# EAGLE schematic RelayBoard (EAGLE 9.6.2)

## Sheet 1 of 9: Frontend
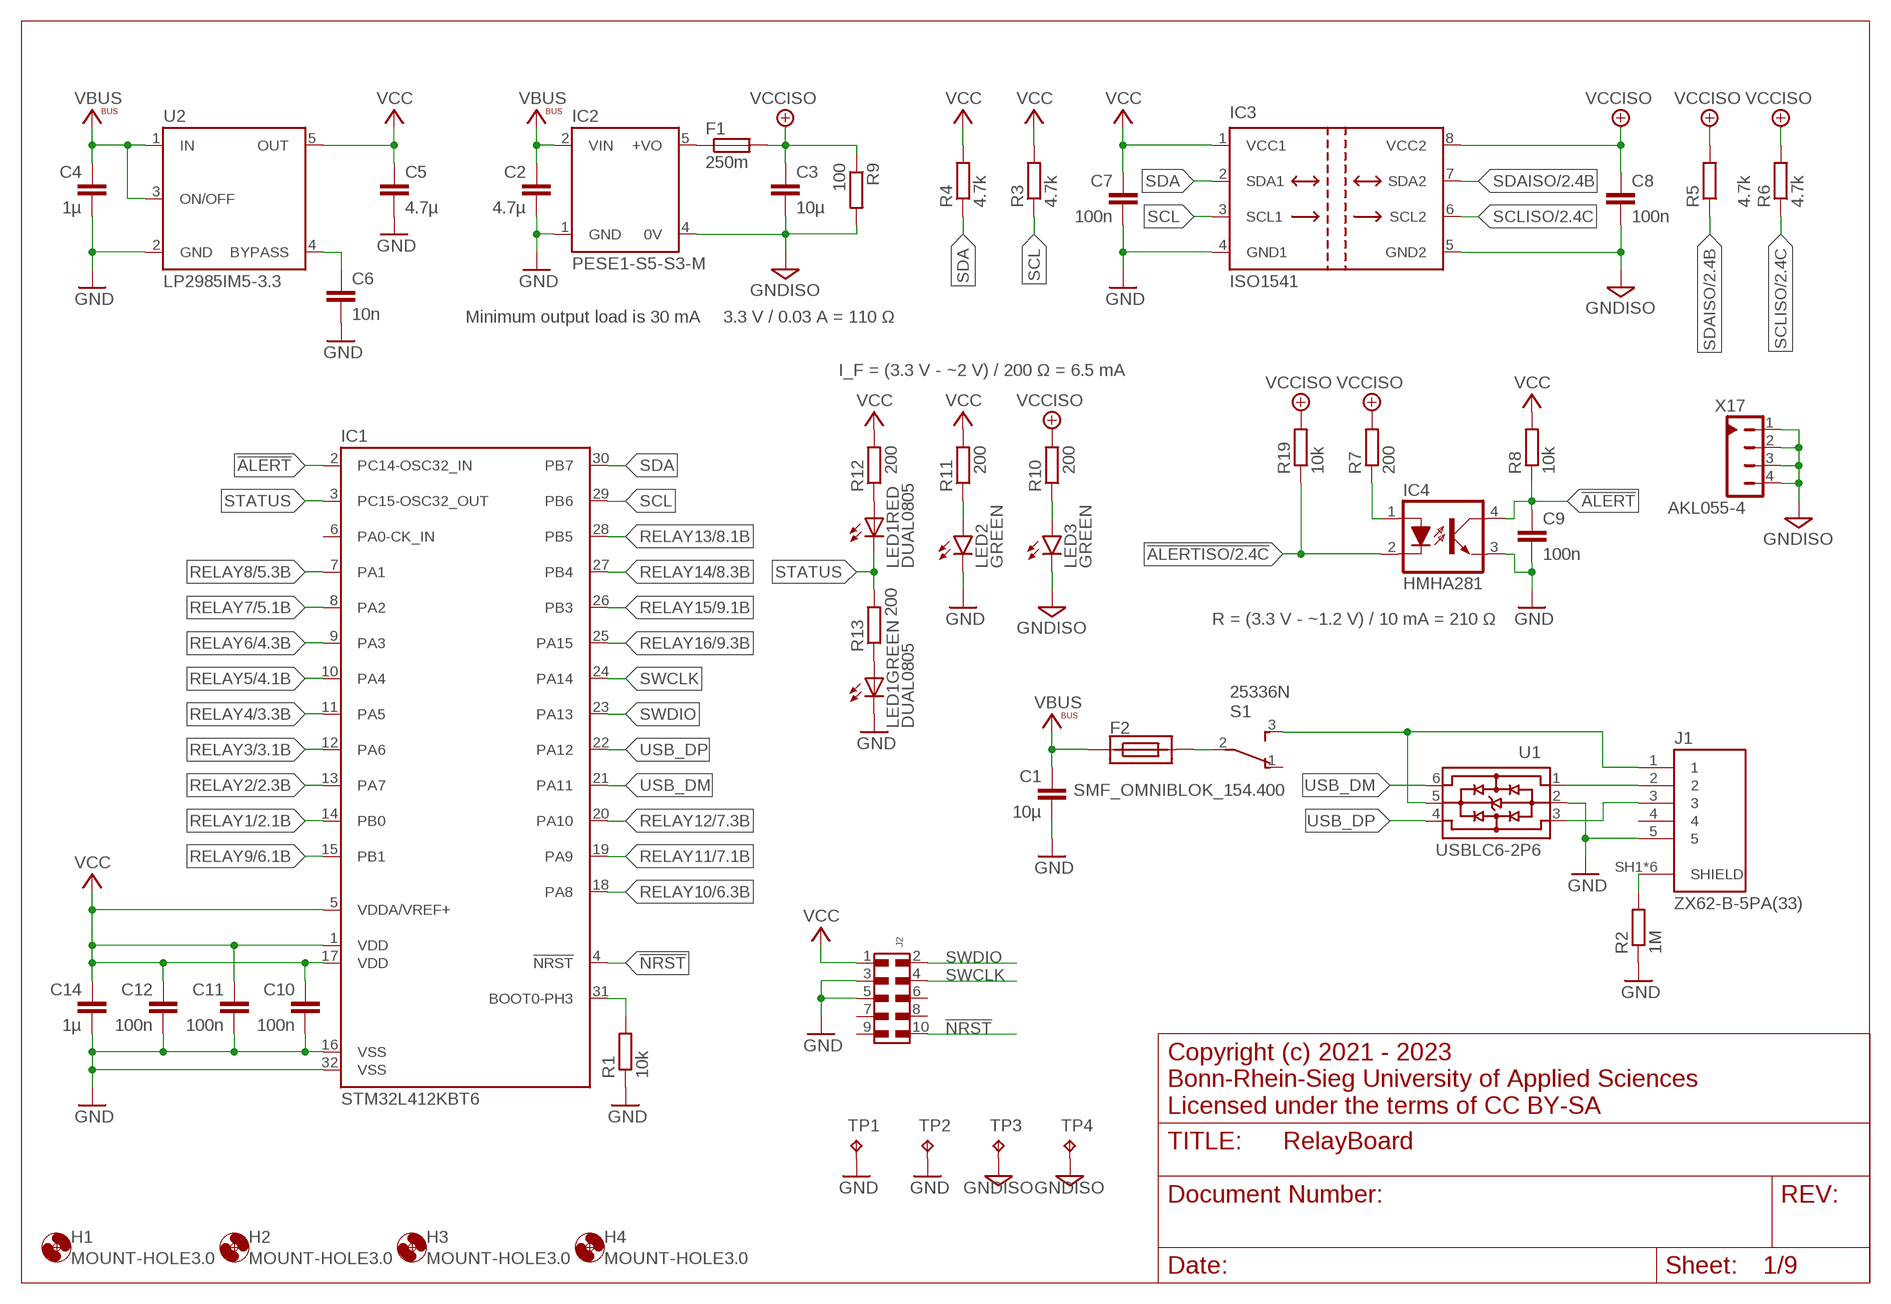
[diagram p0: schematic, sheet 1]

### Parts
C1  10µ  C-EUC0805  [C0805]
C2  4.7µ  C-EUC0805  [C0805]
C3  10µ  C-EUC0805  [C0805]
C4  1µ  C-EUC0805  [C0805]
C5  4.7µ  C-EUC0805  [C0805]
C6  10n  C-EUC0603  [C0603]
C7  100n  C-EUC0603  [C0603]
C8  100n  C-EUC0603  [C0603]
C9  100n  C-EUC0603  [C0603]
C10  100n  C-EUC0603  [C0603]
C11  100n  C-EUC0603  [C0603]
C12  100n  C-EUC0603  [C0603]
C14  1µ  C-EUC0603  [C0603]
F1  250m  FUSE0603  [R0603]
F2  SMF_OMNIBLOK_154.400  [NANO2_SMF_FUSEBLOCK]
H1  MOUNT-HOLE3.0  [3,0]
H2  MOUNT-HOLE3.0  [3,0]
H3  MOUNT-HOLE3.0  [3,0]
H4  MOUNT-HOLE3.0  [3,0]
IC1  STM32L412KBT6  [LQFP32]
IC2  PESE1-S5-S3-M  [PESE1-M]
IC3  ISO1541  [SOIC8]
IC4  HMHA281  [4-MINI-FLAT]
J1  ZX62-B-5PA(33)  [HRS_ZX62-B-5PA(33)]
J2  6210XX21021_62101021021  [62101021021]
LED1  DUAL0805  [CHIPLEDX2]
LED2  GREEN  LEDCHIPLED_0805  [CHIPLED_0805]
LED3  GREEN  LEDCHIPLED_0805  [CHIPLED_0805]
R1  10k  R-EU_R0603  [R0603]
R2  1M  R-EU_R0603  [R0603]
R3  4.7k  R-EU_R0603  [R0603]
R4  4.7k  R-EU_R0603  [R0603]
R5  4.7k  R-EU_R0603  [R0603]
R6  4.7k  R-EU_R0603  [R0603]
R7  200  R-EU_R0603  [R0603]
R8  10k  R-EU_R0603  [R0603]
R9  100  R-EU_R0603  [R0603]
R10  200  R-EU_R0603  [R0603]
R11  200  R-EU_R0603  [R0603]
R12  200  R-EU_R0603  [R0603]
R13  200  R-EU_R0603  [R0603]
R19  10k  R-EU_R0603  [R0603]
S1  25336N  [2533XN]
TP1  TP3.8X2.03  [3.8X2.03]
TP2  TP3.8X2.03  [3.8X2.03]
TP3  TP3.8X2.03  [3.8X2.03]
TP4  TP3.8X2.03  [3.8X2.03]
U1  USBLC6-2P6  [SOT-666]
U2  LP2985IM5-3.3  [SOT23-5]
X17  AKL055-4  [AKL055-4]

### Nets
!ALERT: C9.1 IC1.2(PC14-OSC32_IN) IC4.4(COLLECTOR) R8.1
!ALERTISO: IC4.2(CATHODE) R19.1 ; also sheet 2,3,4,5,6,7,8,9
!NRST: IC1.4(!NRST) J2.10
GND: C1.2 C2.2 C4.2 C5.2 C6.2 C7.2 C9.2 C10.2 C11.2 C12.2 C14.2 IC1.16(VSS) IC1.32(VSS) IC2.1(GND) IC3.4(GND1) IC4.3(EMITTER) J1.5 J2.3 J2.5 LED1.C2(GREEN:C) LED2.C R1.1 R2.1 TP1.TP TP2.TP U1.2 U2.2(GND) ; also sheet 2,3,4,5,6,7,8,9
GNDISO: C3.2 C8.2 IC2.4(0V) IC3.5(GND2) LED3.C R9.2 TP3.TP TP4.TP X17.1 X17.2 X17.3 X17.4 ; also sheet 2,3,4,5,6,7,8,9
N$1: J1.2 U1.1
N$2: J1.3 U1.3
N$3: J1.SH1(SHIELD) J1.SH2(SHIELD) J1.SH3(SHIELD) J1.SH4(SHIELD) J1.SH5(SHIELD) J1.SH6(SHIELD) R2.2
N$4: IC4.1(ANODE) R7.1
N$5: C6.1 U2.4(BYPASS)
N$6: IC1.31(BOOT0-PH3) R1.2
N$7: LED3.A R10.1
N$8: LED2.A R11.1
N$9: LED1.A2(GREEN:A) R13.1
N$10: LED1.A1(RED:A) R12.1
N$12: J1.1 S1.3 U1.5
N$17: F2.2 S1.2
N$18: F1.1 IC2.5(+VO)
RELAY1: IC1.14(PB0) ; also sheet 2
RELAY2: IC1.13(PA7) ; also sheet 2
RELAY3: IC1.12(PA6) ; also sheet 3
RELAY4: IC1.11(PA5) ; also sheet 3
RELAY5: IC1.10(PA4) ; also sheet 4
RELAY6: IC1.9(PA3) ; also sheet 4
RELAY7: IC1.8(PA2) ; also sheet 5
RELAY8: IC1.7(PA1) ; also sheet 5
RELAY9: IC1.15(PB1) ; also sheet 6
RELAY10: IC1.18(PA8) ; also sheet 6
RELAY11: IC1.19(PA9) ; also sheet 7
RELAY12: IC1.20(PA10) ; also sheet 7
RELAY13: IC1.28(PB5) ; also sheet 8
RELAY14: IC1.27(PB4) ; also sheet 8
RELAY15: IC1.26(PB3) ; also sheet 9
RELAY16: IC1.25(PA15) ; also sheet 9
SCL: IC1.29(PB6) IC3.3(SCL1) R3.1
SCLISO: IC3.6(SCL2) R6.1 ; also sheet 2,3,4,5,6,7,8,9
SDA: IC1.30(PB7) IC3.2(SDA1) R4.1
SDAISO: IC3.7(SDA2) R5.1 ; also sheet 2,3,4,5,6,7,8,9
STATUS: IC1.3(PC15-OSC32_OUT) LED1.C1(RED:C) R13.2
SWCLK: IC1.24(PA14) J2.4
SWDIO: IC1.23(PA13) J2.2
USB_DM: IC1.21(PA11) U1.6
USB_DP: IC1.22(PA12) U1.4
VBUS: C1.1 C2.1 C4.1 F2.1 IC2.2(VIN) U2.1(IN) U2.3(ON/OFF) ; also sheet 2,3,4,5,6,7,8,9
VCC: C5.1 C7.1 C10.1 C11.1 C12.1 C14.1 IC1.1(VDD) IC1.5(VDDA/VREF+) IC1.17(VDD) IC3.1(VCC1) J2.1 R3.2 R4.2 R8.2 R11.2 R12.2 U2.5(OUT)
VCCISO: C3.1 C8.1 F1.2 IC3.8(VCC2) R5.2 R6.2 R7.2 R9.1 R10.2 R19.2 ; also sheet 2,3,4,5,6,7,8,9
Unconnected: IC1.6(PA0-CK_IN) J1.4 J2.6 J2.7 J2.8 J2.9 S1.1

### Notes on the sheet
- Minimum output load is 30 mA ⇒ 3.3 V / 0.03 A = 110 Ω
- I_F = (3.3 V - ~2 V) / 200 Ω = 6.5 mA
- R = (3.3 V - ~1.2 V) / 10 mA = 210 Ω
- Copyright (c) 2021 - 2023
  Bonn-Rhein-Sieg University of Applied Sciences
  Licensed under the terms of CC BY-SA

## Sheet 2 of 9: Relays 1
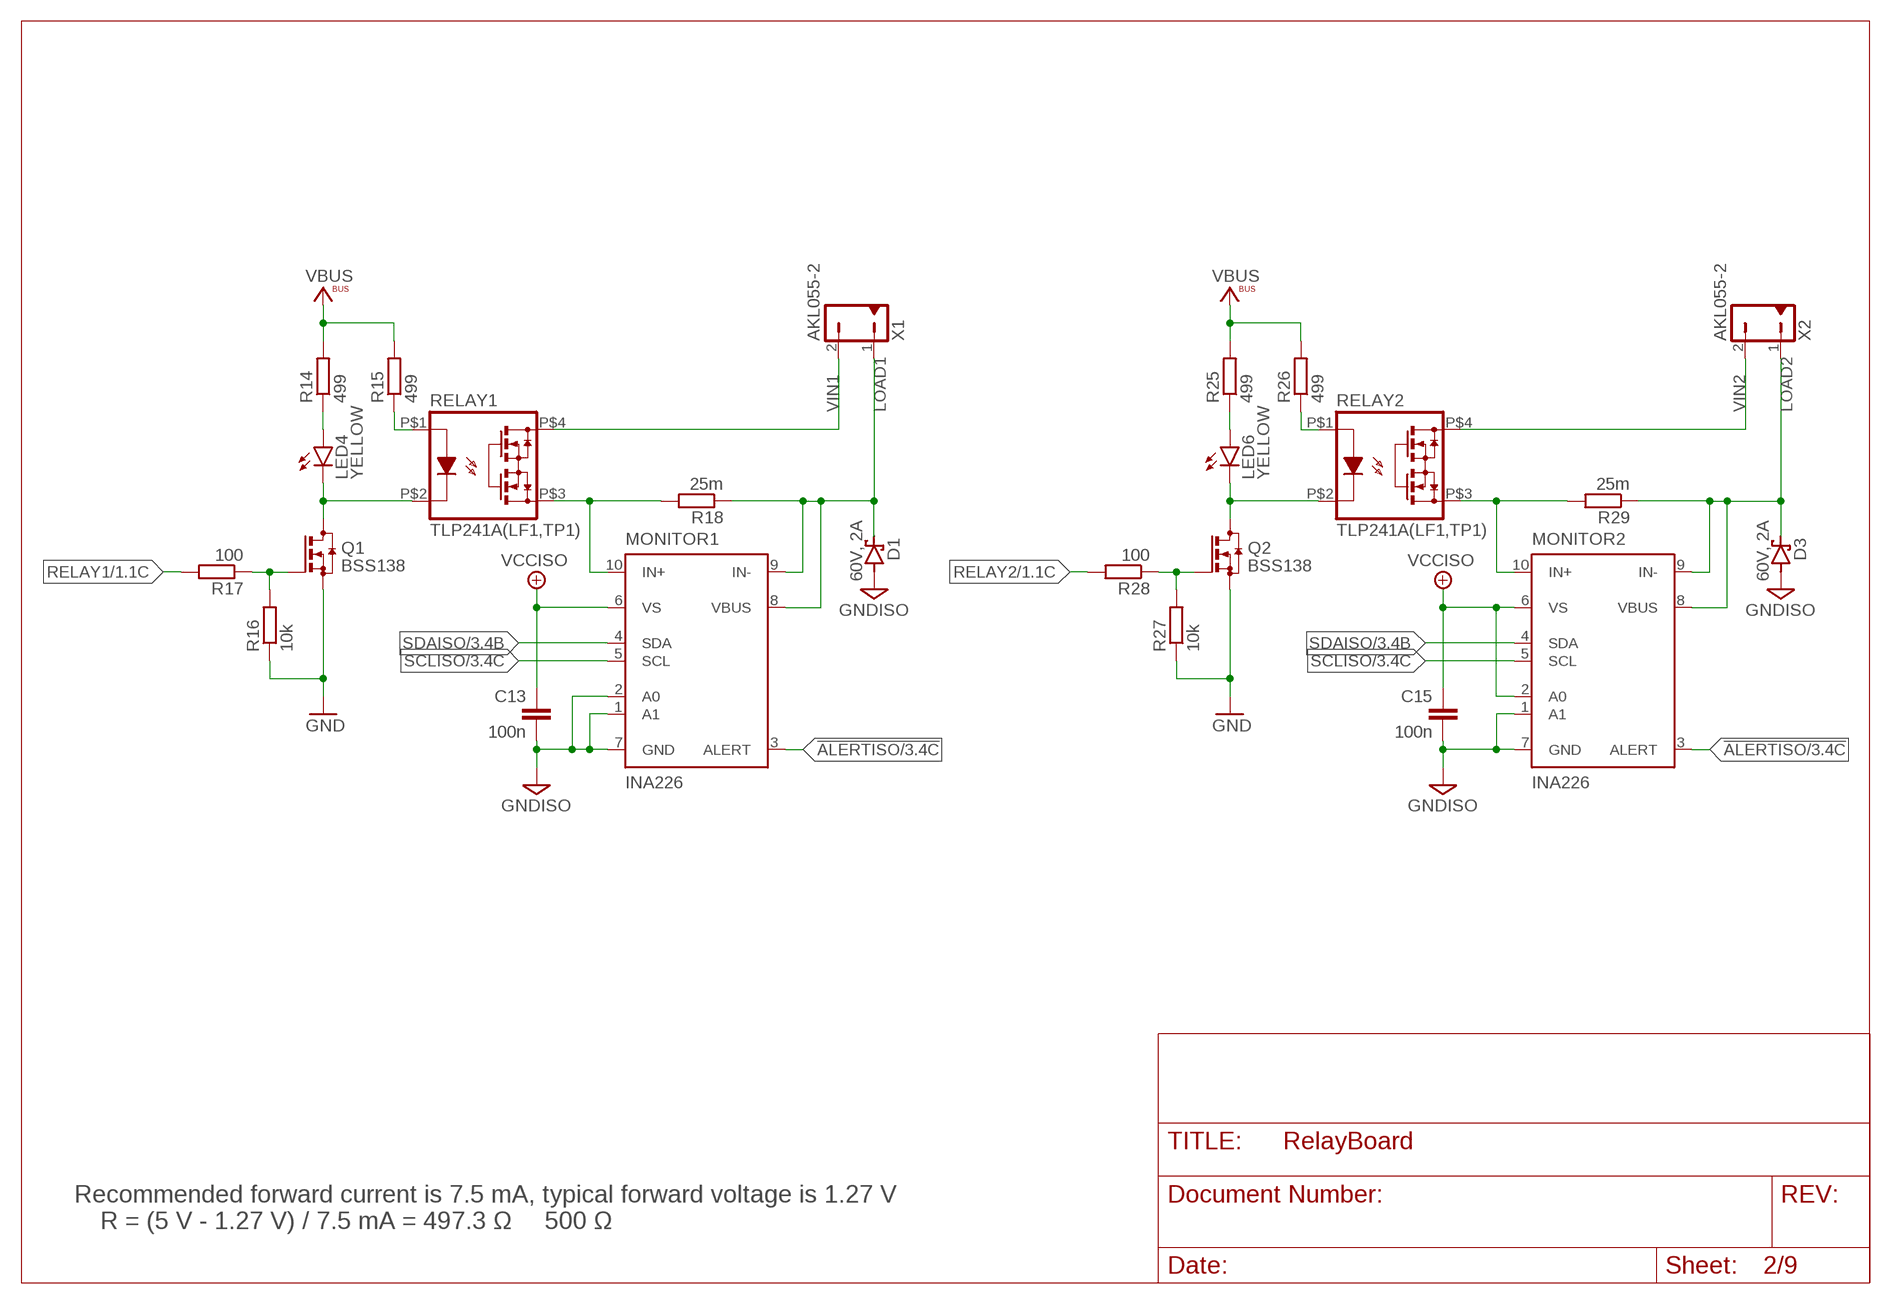
[diagram p1: schematic, sheet 2]

### Parts
C13  100n  C-EUC0603  [C0603]
C15  100n  C-EUC0603  [C0603]
D1  60V, 2A  SCHOTTKY-DIODESMD  [SMB]
D3  60V, 2A  SCHOTTKY-DIODESMD  [SMB]
LED4  YELLOW  LEDCHIPLED_0805  [CHIPLED_0805]
LED6  YELLOW  LEDCHIPLED_0805  [CHIPLED_0805]
MONITOR1  INA226  [MSOP10]
MONITOR2  INA226  [MSOP10]
Q1  BSS138  [SOT23]
Q2  BSS138  [SOT23]
R14  499  R-EU_R0603  [R0603]
R15  499  R-EU_R0603  [R0603]
R16  10k  R-EU_R0603  [R0603]
R17  100  R-EU_R0603  [R0603]
R18  25m  R-EU_R1206  [R1206]
R25  499  R-EU_R0603  [R0603]
R26  499  R-EU_R0603  [R0603]
R27  10k  R-EU_R0603  [R0603]
R28  100  R-EU_R0603  [R0603]
R29  25m  R-EU_R1206  [R1206]
RELAY1  TLP241A(LF1,TP1)  [TP1/5]
RELAY2  TLP241A(LF1,TP1)  [TP1/5]
X1  AKL055-2  [AKL055-2]
X2  AKL055-2  [AKL055-2]

### Nets
!ALERTISO: MONITOR1.3(ALERT) MONITOR2.3(ALERT) ; also sheet 1,3,4,5,6,7,8,9
GND: Q1.2(S) Q2.2(S) R16.1 R27.1 ; also sheet 1,3,4,5,6,7,8,9
GNDISO: C13.2 C15.2 D1.A D3.A MONITOR1.1(A1) MONITOR1.2(A0) MONITOR1.7(GND) MONITOR2.1(A1) MONITOR2.7(GND) ; also sheet 1,3,4,5,6,7,8,9
LOAD1: D1.C MONITOR1.8(VBUS) MONITOR1.9(IN-) R18.1 X1.1
LOAD2: D3.C MONITOR2.8(VBUS) MONITOR2.9(IN-) R29.1 X2.1
N$11: LED4.A R14.1
N$13: LED4.C Q1.3(D) RELAY1.P$2(CATHODE)
N$14: Q1.1(G) R16.2 R17.1
N$15: MONITOR1.10(IN+) R18.2 RELAY1.P$3(DRAIN1)
N$16: R15.1 RELAY1.P$1(ANODE)
N$25: LED6.A R25.1
N$26: LED6.C Q2.3(D) RELAY2.P$2(CATHODE)
N$27: Q2.1(G) R27.2 R28.1
N$28: MONITOR2.10(IN+) R29.2 RELAY2.P$3(DRAIN1)
N$31: R26.1 RELAY2.P$1(ANODE)
RELAY1: R17.2 ; also sheet 1
RELAY2: R28.2 ; also sheet 1
SCLISO: MONITOR1.5(SCL) MONITOR2.5(SCL) ; also sheet 1,3,4,5,6,7,8,9
SDAISO: MONITOR1.4(SDA) MONITOR2.4(SDA) ; also sheet 1,3,4,5,6,7,8,9
VBUS: R14.2 R15.2 R25.2 R26.2 ; also sheet 1,3,4,5,6,7,8,9
VCCISO: C13.1 C15.1 MONITOR1.6(VS) MONITOR2.2(A0) MONITOR2.6(VS) ; also sheet 1,3,4,5,6,7,8,9
VIN1: RELAY1.P$4(DRAIN2) X1.2
VIN2: RELAY2.P$4(DRAIN2) X2.2

### Notes on the sheet
- Recommended forward current is 7.5 mA, typical forward voltage is 1.27 V
  ⇒ R = (5 V - 1.27 V) / 7.5 mA = 497.3 Ω ≅ 500 Ω

## Sheet 3 of 9: Relays 2
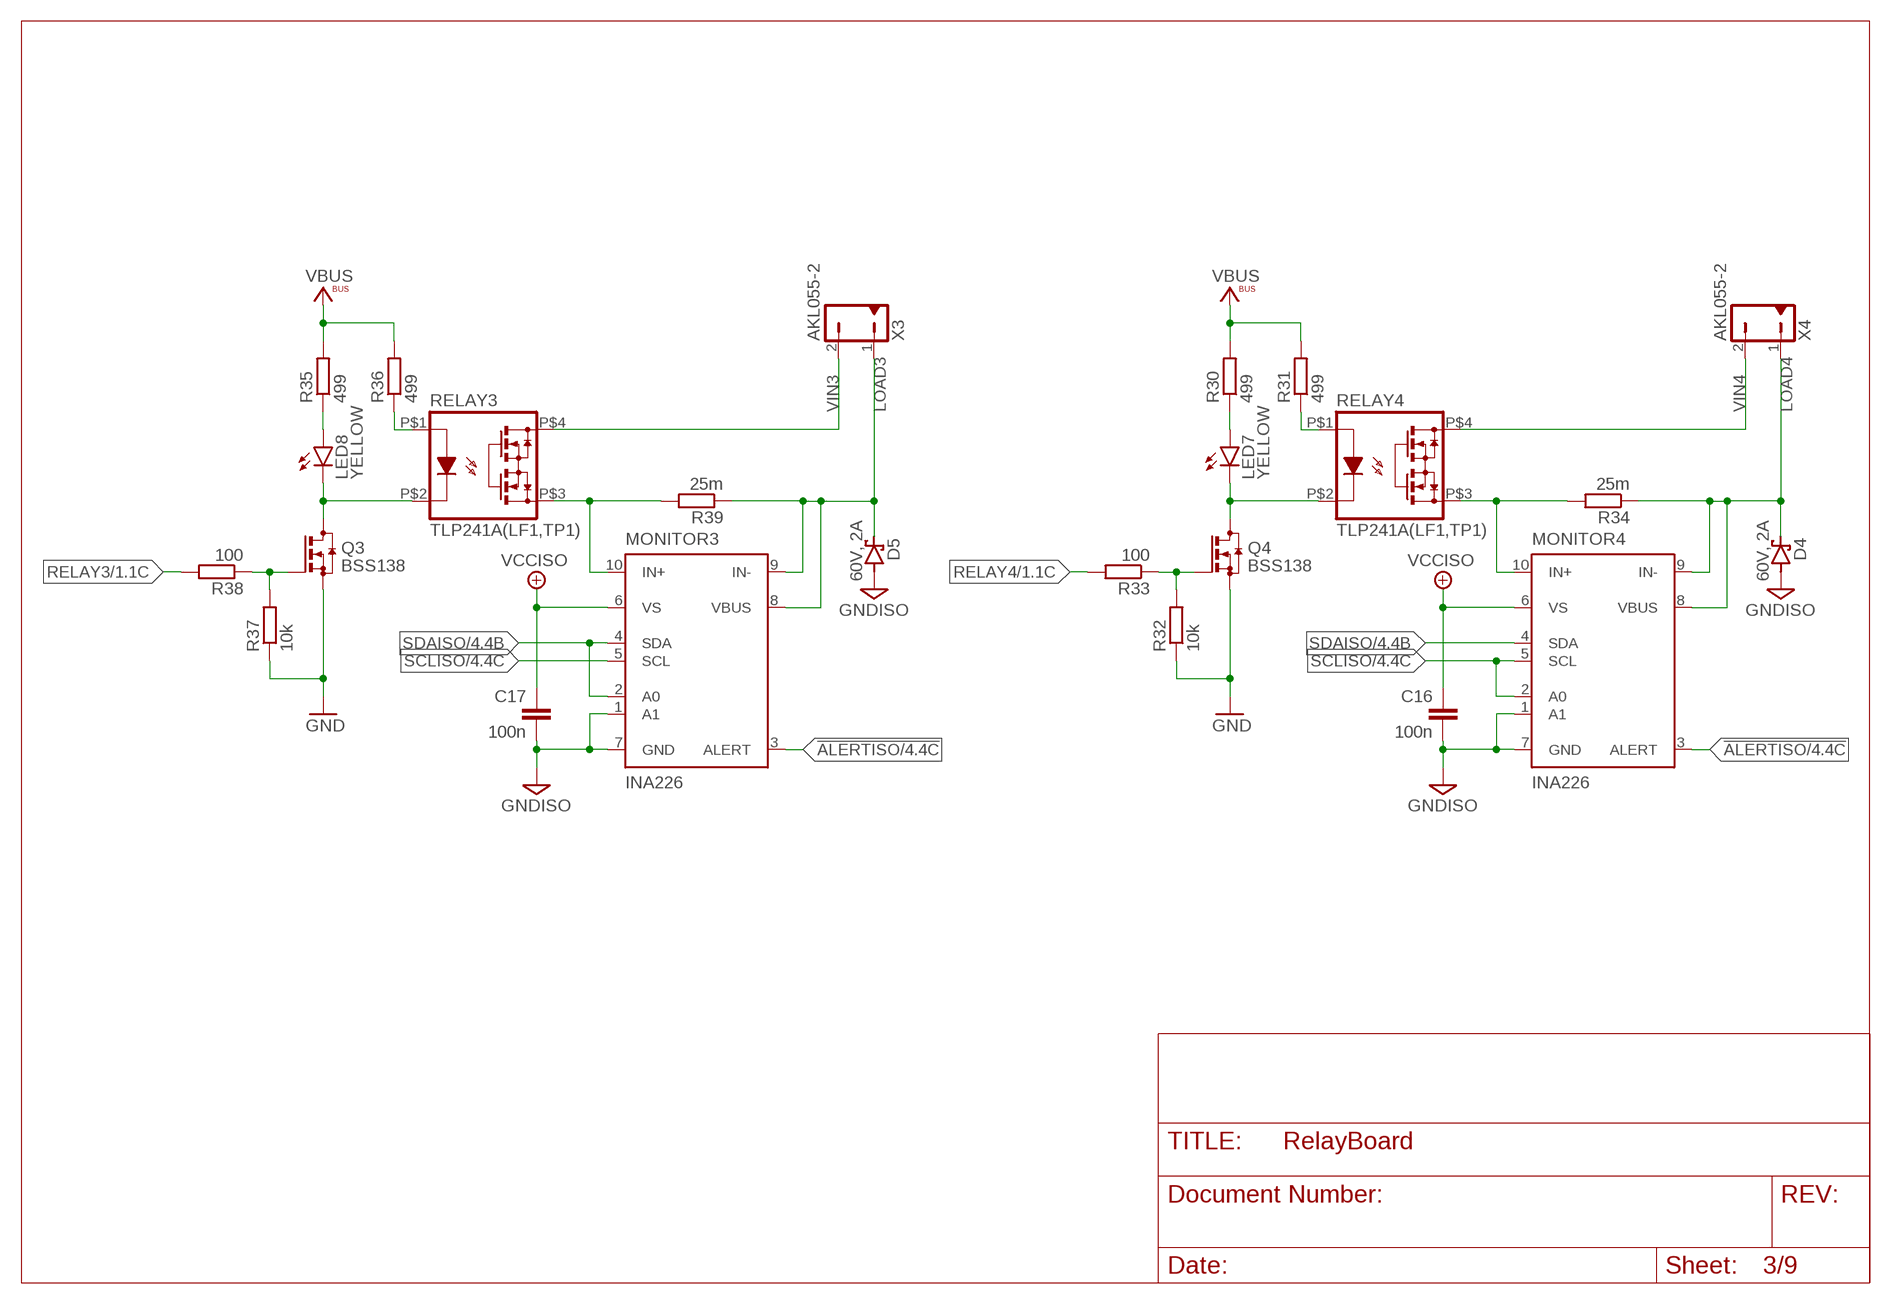
[diagram p2: schematic, sheet 3]

### Parts
C16  100n  C-EUC0603  [C0603]
C17  100n  C-EUC0603  [C0603]
D4  60V, 2A  SCHOTTKY-DIODESMD  [SMB]
D5  60V, 2A  SCHOTTKY-DIODESMD  [SMB]
LED7  YELLOW  LEDCHIPLED_0805  [CHIPLED_0805]
LED8  YELLOW  LEDCHIPLED_0805  [CHIPLED_0805]
MONITOR3  INA226  [MSOP10]
MONITOR4  INA226  [MSOP10]
Q3  BSS138  [SOT23]
Q4  BSS138  [SOT23]
R30  499  R-EU_R0603  [R0603]
R31  499  R-EU_R0603  [R0603]
R32  10k  R-EU_R0603  [R0603]
R33  100  R-EU_R0603  [R0603]
R34  25m  R-EU_R1206  [R1206]
R35  499  R-EU_R0603  [R0603]
R36  499  R-EU_R0603  [R0603]
R37  10k  R-EU_R0603  [R0603]
R38  100  R-EU_R0603  [R0603]
R39  25m  R-EU_R1206  [R1206]
RELAY3  TLP241A(LF1,TP1)  [TP1/5]
RELAY4  TLP241A(LF1,TP1)  [TP1/5]
X3  AKL055-2  [AKL055-2]
X4  AKL055-2  [AKL055-2]

### Nets
!ALERTISO: MONITOR3.3(ALERT) MONITOR4.3(ALERT) ; also sheet 1,2,4,5,6,7,8,9
GND: Q3.2(S) Q4.2(S) R32.1 R37.1 ; also sheet 1,2,4,5,6,7,8,9
GNDISO: C16.2 C17.2 D4.A D5.A MONITOR3.1(A1) MONITOR3.7(GND) MONITOR4.1(A1) MONITOR4.7(GND) ; also sheet 1,2,4,5,6,7,8,9
LOAD3: D5.C MONITOR3.8(VBUS) MONITOR3.9(IN-) R39.1 X3.1
LOAD4: D4.C MONITOR4.8(VBUS) MONITOR4.9(IN-) R34.1 X4.1
N$32: LED7.A R30.1
N$33: LED7.C Q4.3(D) RELAY4.P$2(CATHODE)
N$34: Q4.1(G) R32.2 R33.1
N$35: MONITOR4.10(IN+) R34.2 RELAY4.P$3(DRAIN1)
N$38: R31.1 RELAY4.P$1(ANODE)
N$39: LED8.A R35.1
N$40: LED8.C Q3.3(D) RELAY3.P$2(CATHODE)
N$41: Q3.1(G) R37.2 R38.1
N$42: MONITOR3.10(IN+) R39.2 RELAY3.P$3(DRAIN1)
N$45: R36.1 RELAY3.P$1(ANODE)
RELAY3: R38.2 ; also sheet 1
RELAY4: R33.2 ; also sheet 1
SCLISO: MONITOR3.5(SCL) MONITOR4.2(A0) MONITOR4.5(SCL) ; also sheet 1,2,4,5,6,7,8,9
SDAISO: MONITOR3.2(A0) MONITOR3.4(SDA) MONITOR4.4(SDA) ; also sheet 1,2,4,5,6,7,8,9
VBUS: R30.2 R31.2 R35.2 R36.2 ; also sheet 1,2,4,5,6,7,8,9
VCCISO: C16.1 C17.1 MONITOR3.6(VS) MONITOR4.6(VS) ; also sheet 1,2,4,5,6,7,8,9
VIN3: RELAY3.P$4(DRAIN2) X3.2
VIN4: RELAY4.P$4(DRAIN2) X4.2

## Sheet 4 of 9: Relays 3
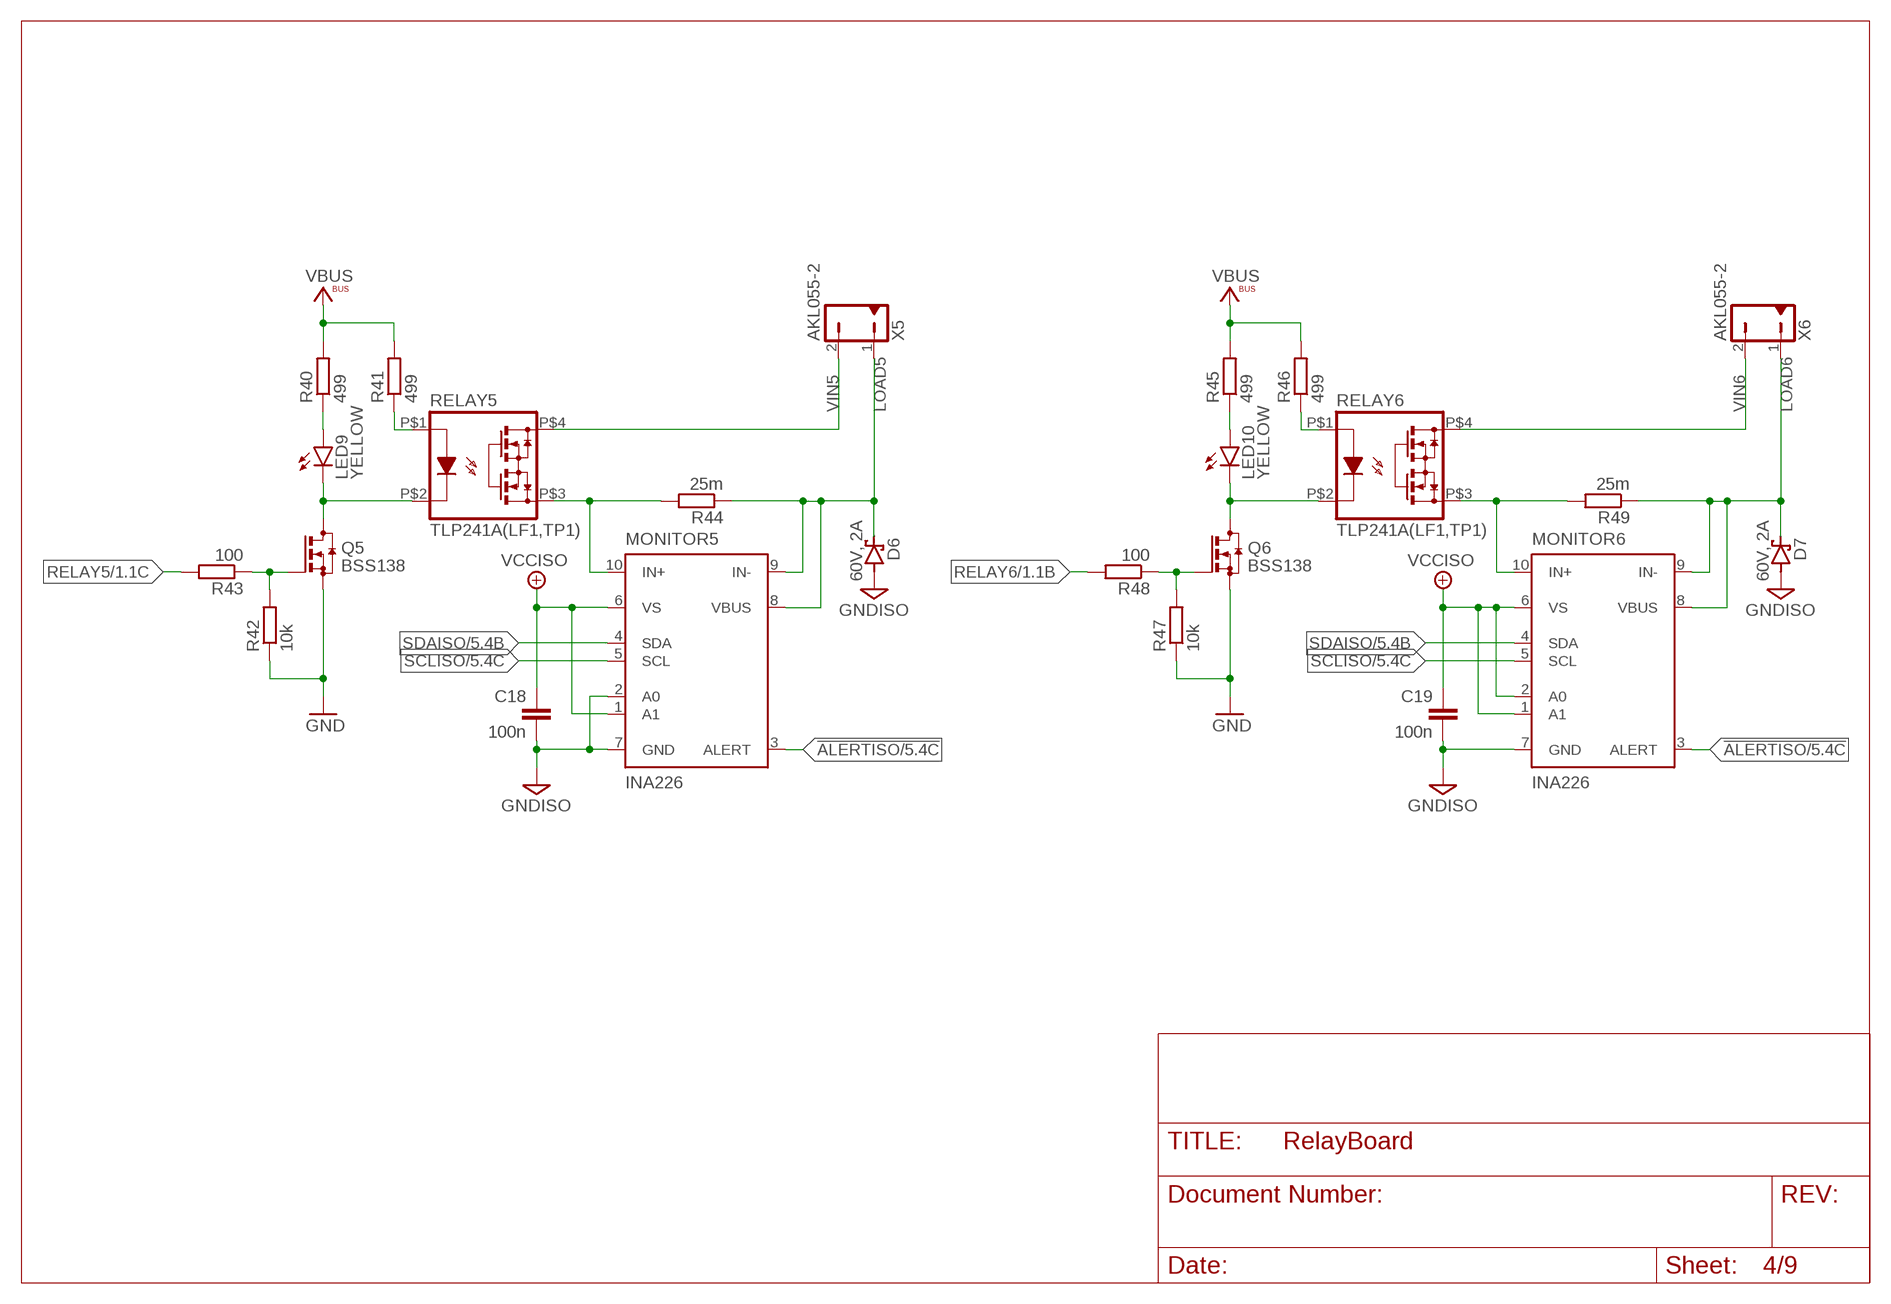
[diagram p3: schematic, sheet 4]

### Parts
C18  100n  C-EUC0603  [C0603]
C19  100n  C-EUC0603  [C0603]
D6  60V, 2A  SCHOTTKY-DIODESMD  [SMB]
D7  60V, 2A  SCHOTTKY-DIODESMD  [SMB]
LED9  YELLOW  LEDCHIPLED_0805  [CHIPLED_0805]
LED10  YELLOW  LEDCHIPLED_0805  [CHIPLED_0805]
MONITOR5  INA226  [MSOP10]
MONITOR6  INA226  [MSOP10]
Q5  BSS138  [SOT23]
Q6  BSS138  [SOT23]
R40  499  R-EU_R0603  [R0603]
R41  499  R-EU_R0603  [R0603]
R42  10k  R-EU_R0603  [R0603]
R43  100  R-EU_R0603  [R0603]
R44  25m  R-EU_R1206  [R1206]
R45  499  R-EU_R0603  [R0603]
R46  499  R-EU_R0603  [R0603]
R47  10k  R-EU_R0603  [R0603]
R48  100  R-EU_R0603  [R0603]
R49  25m  R-EU_R1206  [R1206]
RELAY5  TLP241A(LF1,TP1)  [TP1/5]
RELAY6  TLP241A(LF1,TP1)  [TP1/5]
X5  AKL055-2  [AKL055-2]
X6  AKL055-2  [AKL055-2]

### Nets
!ALERTISO: MONITOR5.3(ALERT) MONITOR6.3(ALERT) ; also sheet 1,2,3,5,6,7,8,9
GND: Q5.2(S) Q6.2(S) R42.1 R47.1 ; also sheet 1,2,3,5,6,7,8,9
GNDISO: C18.2 C19.2 D6.A D7.A MONITOR5.2(A0) MONITOR5.7(GND) MONITOR6.7(GND) ; also sheet 1,2,3,5,6,7,8,9
LOAD5: D6.C MONITOR5.8(VBUS) MONITOR5.9(IN-) R44.1 X5.1
LOAD6: D7.C MONITOR6.8(VBUS) MONITOR6.9(IN-) R49.1 X6.1
N$46: LED9.A R40.1
N$47: LED9.C Q5.3(D) RELAY5.P$2(CATHODE)
N$48: Q5.1(G) R42.2 R43.1
N$49: MONITOR5.10(IN+) R44.2 RELAY5.P$3(DRAIN1)
N$52: R41.1 RELAY5.P$1(ANODE)
N$53: LED10.A R45.1
N$54: LED10.C Q6.3(D) RELAY6.P$2(CATHODE)
N$55: Q6.1(G) R47.2 R48.1
N$56: MONITOR6.10(IN+) R49.2 RELAY6.P$3(DRAIN1)
N$59: R46.1 RELAY6.P$1(ANODE)
RELAY5: R43.2 ; also sheet 1
RELAY6: R48.2 ; also sheet 1
SCLISO: MONITOR5.5(SCL) MONITOR6.5(SCL) ; also sheet 1,2,3,5,6,7,8,9
SDAISO: MONITOR5.4(SDA) MONITOR6.4(SDA) ; also sheet 1,2,3,5,6,7,8,9
VBUS: R40.2 R41.2 R45.2 R46.2 ; also sheet 1,2,3,5,6,7,8,9
VCCISO: C18.1 C19.1 MONITOR5.1(A1) MONITOR5.6(VS) MONITOR6.1(A1) MONITOR6.2(A0) MONITOR6.6(VS) ; also sheet 1,2,3,5,6,7,8,9
VIN5: RELAY5.P$4(DRAIN2) X5.2
VIN6: RELAY6.P$4(DRAIN2) X6.2

## Sheet 5 of 9: Relays 4
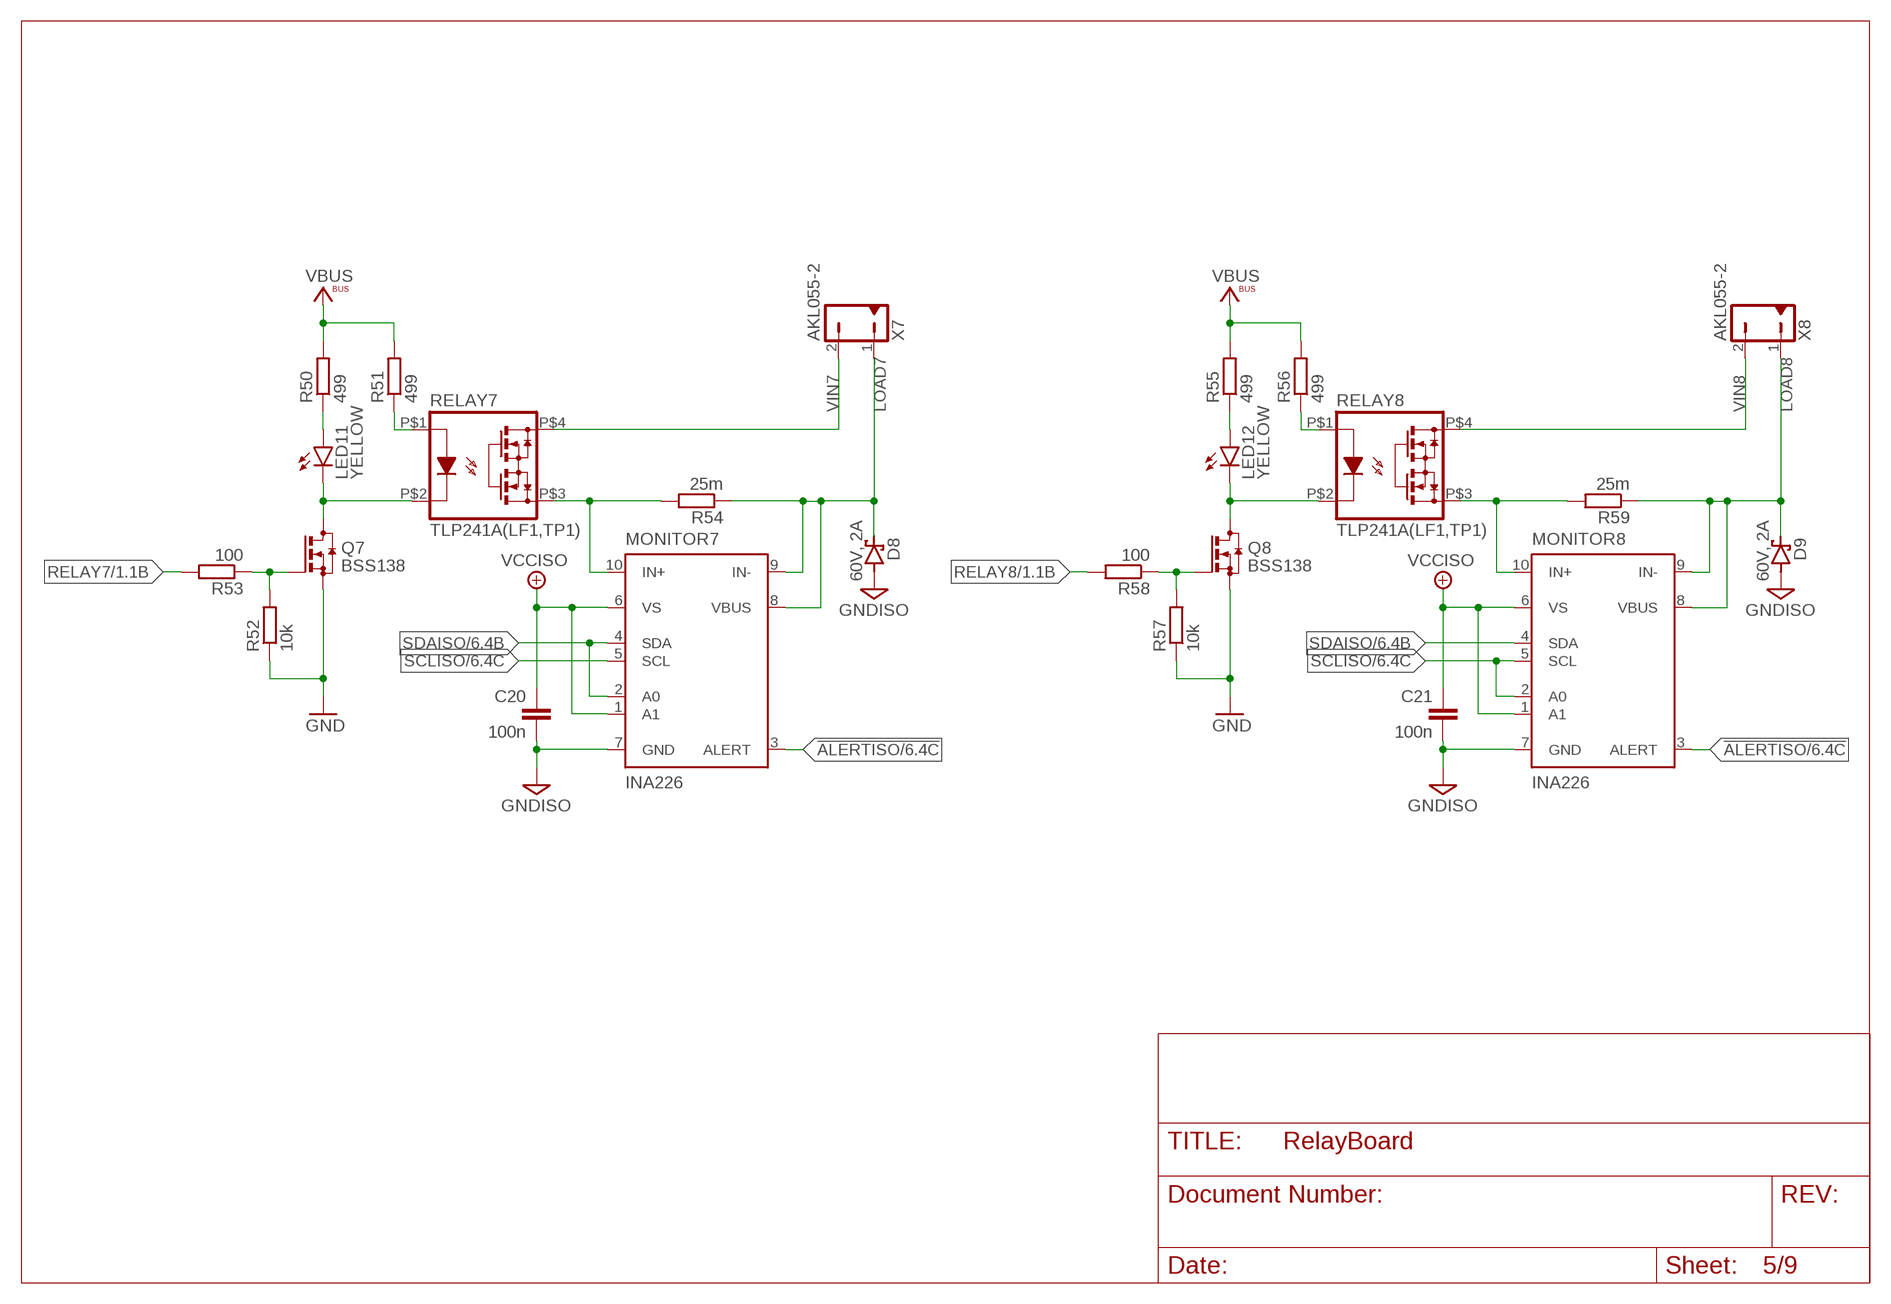
[diagram p4: schematic, sheet 5]

### Parts
C20  100n  C-EUC0603  [C0603]
C21  100n  C-EUC0603  [C0603]
D8  60V, 2A  SCHOTTKY-DIODESMD  [SMB]
D9  60V, 2A  SCHOTTKY-DIODESMD  [SMB]
LED11  YELLOW  LEDCHIPLED_0805  [CHIPLED_0805]
LED12  YELLOW  LEDCHIPLED_0805  [CHIPLED_0805]
MONITOR7  INA226  [MSOP10]
MONITOR8  INA226  [MSOP10]
Q7  BSS138  [SOT23]
Q8  BSS138  [SOT23]
R50  499  R-EU_R0603  [R0603]
R51  499  R-EU_R0603  [R0603]
R52  10k  R-EU_R0603  [R0603]
R53  100  R-EU_R0603  [R0603]
R54  25m  R-EU_R1206  [R1206]
R55  499  R-EU_R0603  [R0603]
R56  499  R-EU_R0603  [R0603]
R57  10k  R-EU_R0603  [R0603]
R58  100  R-EU_R0603  [R0603]
R59  25m  R-EU_R1206  [R1206]
RELAY7  TLP241A(LF1,TP1)  [TP1/5]
RELAY8  TLP241A(LF1,TP1)  [TP1/5]
X7  AKL055-2  [AKL055-2]
X8  AKL055-2  [AKL055-2]

### Nets
!ALERTISO: MONITOR7.3(ALERT) MONITOR8.3(ALERT) ; also sheet 1,2,3,4,6,7,8,9
GND: Q7.2(S) Q8.2(S) R52.1 R57.1 ; also sheet 1,2,3,4,6,7,8,9
GNDISO: C20.2 C21.2 D8.A D9.A MONITOR7.7(GND) MONITOR8.7(GND) ; also sheet 1,2,3,4,6,7,8,9
LOAD7: D8.C MONITOR7.8(VBUS) MONITOR7.9(IN-) R54.1 X7.1
LOAD8: D9.C MONITOR8.8(VBUS) MONITOR8.9(IN-) R59.1 X8.1
N$60: LED11.A R50.1
N$61: LED11.C Q7.3(D) RELAY7.P$2(CATHODE)
N$62: Q7.1(G) R52.2 R53.1
N$63: MONITOR7.10(IN+) R54.2 RELAY7.P$3(DRAIN1)
N$66: R51.1 RELAY7.P$1(ANODE)
N$67: LED12.A R55.1
N$68: LED12.C Q8.3(D) RELAY8.P$2(CATHODE)
N$69: Q8.1(G) R57.2 R58.1
N$70: MONITOR8.10(IN+) R59.2 RELAY8.P$3(DRAIN1)
N$73: R56.1 RELAY8.P$1(ANODE)
RELAY7: R53.2 ; also sheet 1
RELAY8: R58.2 ; also sheet 1
SCLISO: MONITOR7.5(SCL) MONITOR8.2(A0) MONITOR8.5(SCL) ; also sheet 1,2,3,4,6,7,8,9
SDAISO: MONITOR7.2(A0) MONITOR7.4(SDA) MONITOR8.4(SDA) ; also sheet 1,2,3,4,6,7,8,9
VBUS: R50.2 R51.2 R55.2 R56.2 ; also sheet 1,2,3,4,6,7,8,9
VCCISO: C20.1 C21.1 MONITOR7.1(A1) MONITOR7.6(VS) MONITOR8.1(A1) MONITOR8.6(VS) ; also sheet 1,2,3,4,6,7,8,9
VIN7: RELAY7.P$4(DRAIN2) X7.2
VIN8: RELAY8.P$4(DRAIN2) X8.2

## Sheet 6 of 9: Relays 5
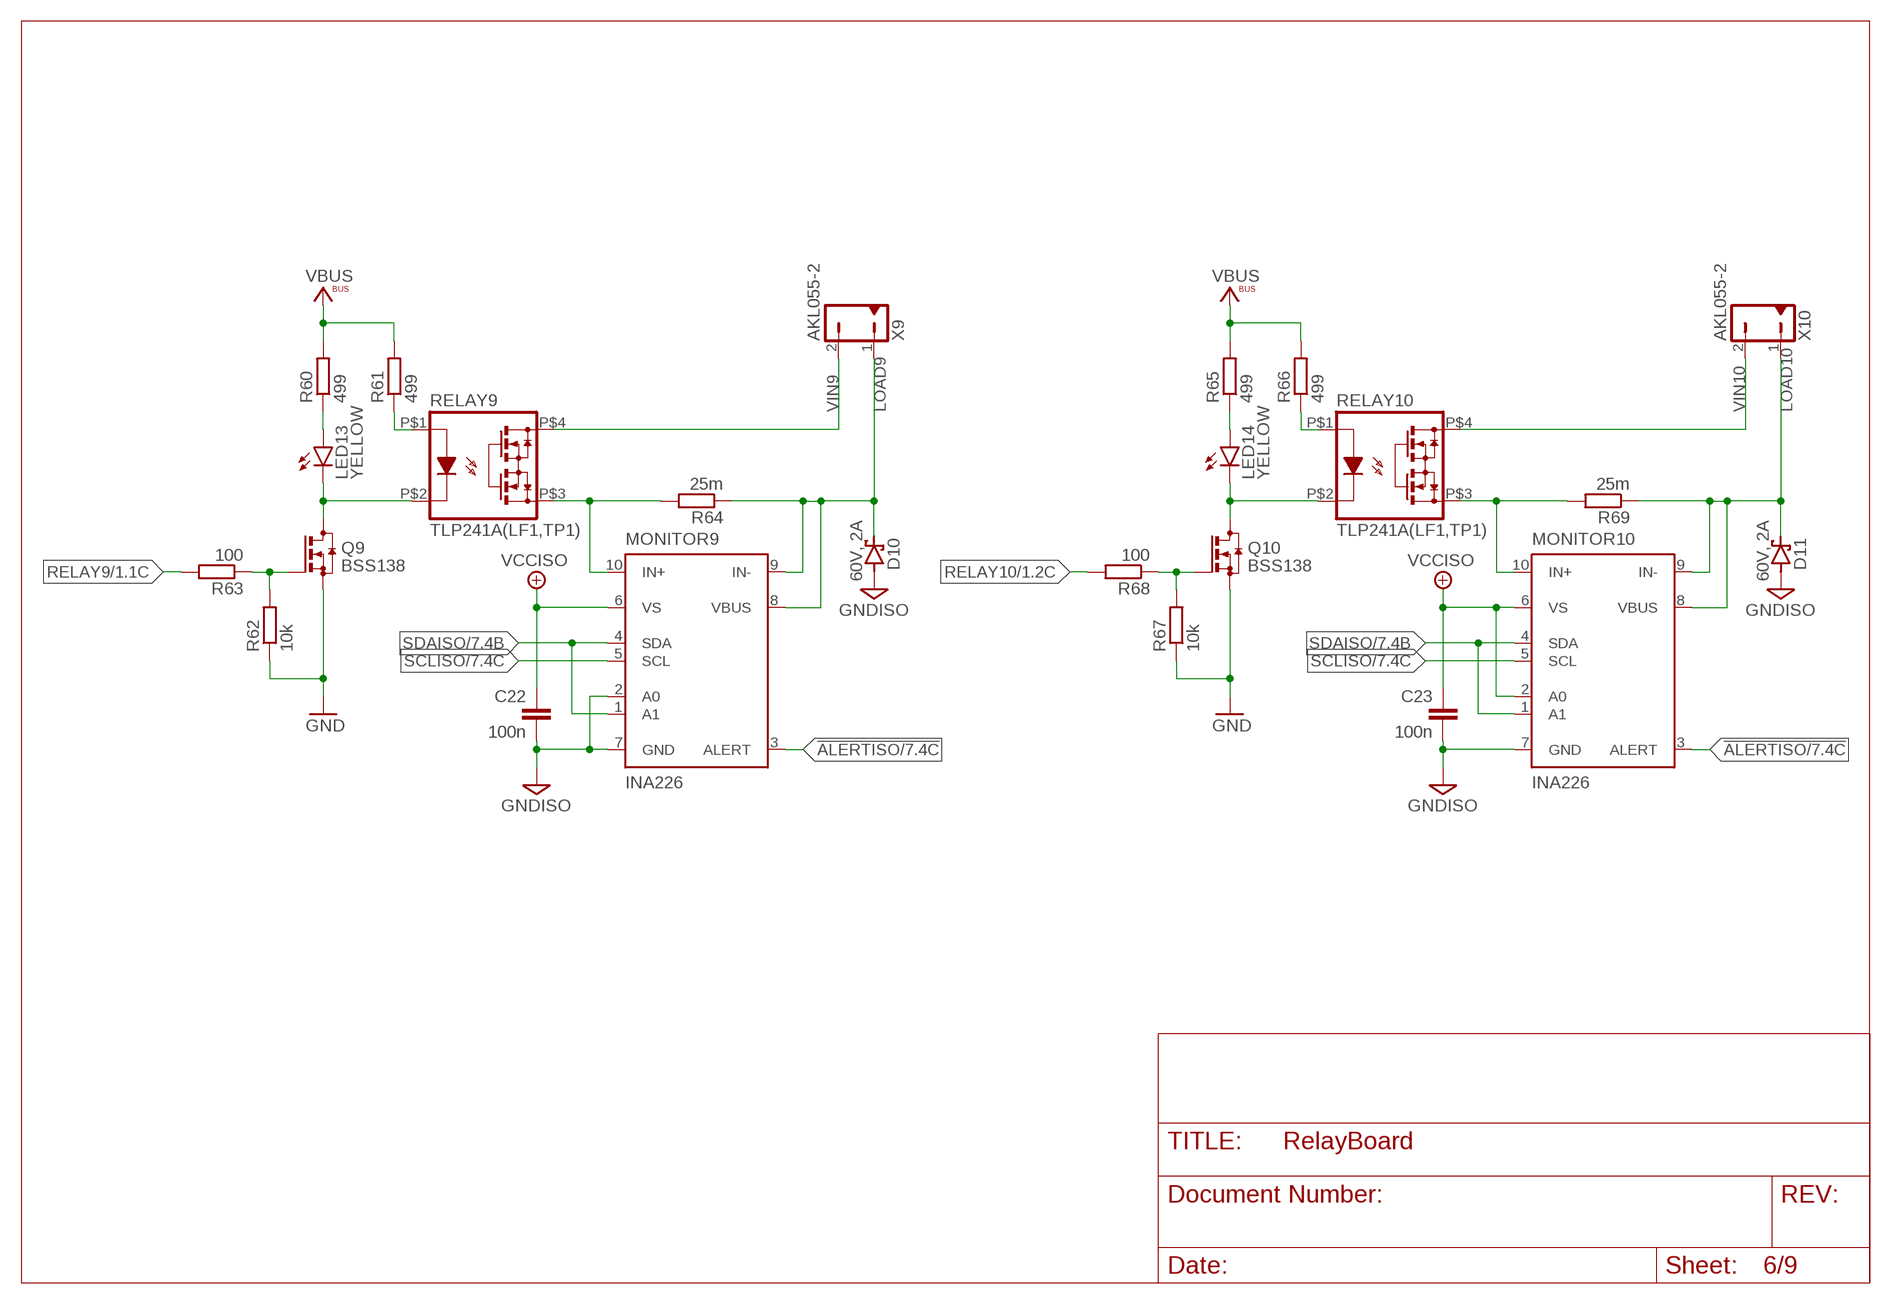
[diagram p5: schematic, sheet 6]

### Parts
C22  100n  C-EUC0603  [C0603]
C23  100n  C-EUC0603  [C0603]
D10  60V, 2A  SCHOTTKY-DIODESMD  [SMB]
D11  60V, 2A  SCHOTTKY-DIODESMD  [SMB]
LED13  YELLOW  LEDCHIPLED_0805  [CHIPLED_0805]
LED14  YELLOW  LEDCHIPLED_0805  [CHIPLED_0805]
MONITOR9  INA226  [MSOP10]
MONITOR10  INA226  [MSOP10]
Q9  BSS138  [SOT23]
Q10  BSS138  [SOT23]
R60  499  R-EU_R0603  [R0603]
R61  499  R-EU_R0603  [R0603]
R62  10k  R-EU_R0603  [R0603]
R63  100  R-EU_R0603  [R0603]
R64  25m  R-EU_R1206  [R1206]
R65  499  R-EU_R0603  [R0603]
R66  499  R-EU_R0603  [R0603]
R67  10k  R-EU_R0603  [R0603]
R68  100  R-EU_R0603  [R0603]
R69  25m  R-EU_R1206  [R1206]
RELAY9  TLP241A(LF1,TP1)  [TP1/5]
RELAY10  TLP241A(LF1,TP1)  [TP1/5]
X9  AKL055-2  [AKL055-2]
X10  AKL055-2  [AKL055-2]

### Nets
!ALERTISO: MONITOR9.3(ALERT) MONITOR10.3(ALERT) ; also sheet 1,2,3,4,5,7,8,9
GND: Q9.2(S) Q10.2(S) R62.1 R67.1 ; also sheet 1,2,3,4,5,7,8,9
GNDISO: C22.2 C23.2 D10.A D11.A MONITOR9.2(A0) MONITOR9.7(GND) MONITOR10.7(GND) ; also sheet 1,2,3,4,5,7,8,9
LOAD9: D10.C MONITOR9.8(VBUS) MONITOR9.9(IN-) R64.1 X9.1
LOAD10: D11.C MONITOR10.8(VBUS) MONITOR10.9(IN-) R69.1 X10.1
N$74: LED13.A R60.1
N$75: LED13.C Q9.3(D) RELAY9.P$2(CATHODE)
N$76: Q9.1(G) R62.2 R63.1
N$77: MONITOR9.10(IN+) R64.2 RELAY9.P$3(DRAIN1)
N$80: R61.1 RELAY9.P$1(ANODE)
N$81: LED14.A R65.1
N$82: LED14.C Q10.3(D) RELAY10.P$2(CATHODE)
N$83: Q10.1(G) R67.2 R68.1
N$84: MONITOR10.10(IN+) R69.2 RELAY10.P$3(DRAIN1)
N$87: R66.1 RELAY10.P$1(ANODE)
RELAY9: R63.2 ; also sheet 1
RELAY10: R68.2 ; also sheet 1
SCLISO: MONITOR9.5(SCL) MONITOR10.5(SCL) ; also sheet 1,2,3,4,5,7,8,9
SDAISO: MONITOR9.1(A1) MONITOR9.4(SDA) MONITOR10.1(A1) MONITOR10.4(SDA) ; also sheet 1,2,3,4,5,7,8,9
VBUS: R60.2 R61.2 R65.2 R66.2 ; also sheet 1,2,3,4,5,7,8,9
VCCISO: C22.1 C23.1 MONITOR9.6(VS) MONITOR10.2(A0) MONITOR10.6(VS) ; also sheet 1,2,3,4,5,7,8,9
VIN9: RELAY9.P$4(DRAIN2) X9.2
VIN10: RELAY10.P$4(DRAIN2) X10.2

## Sheet 7 of 9: Relays 6
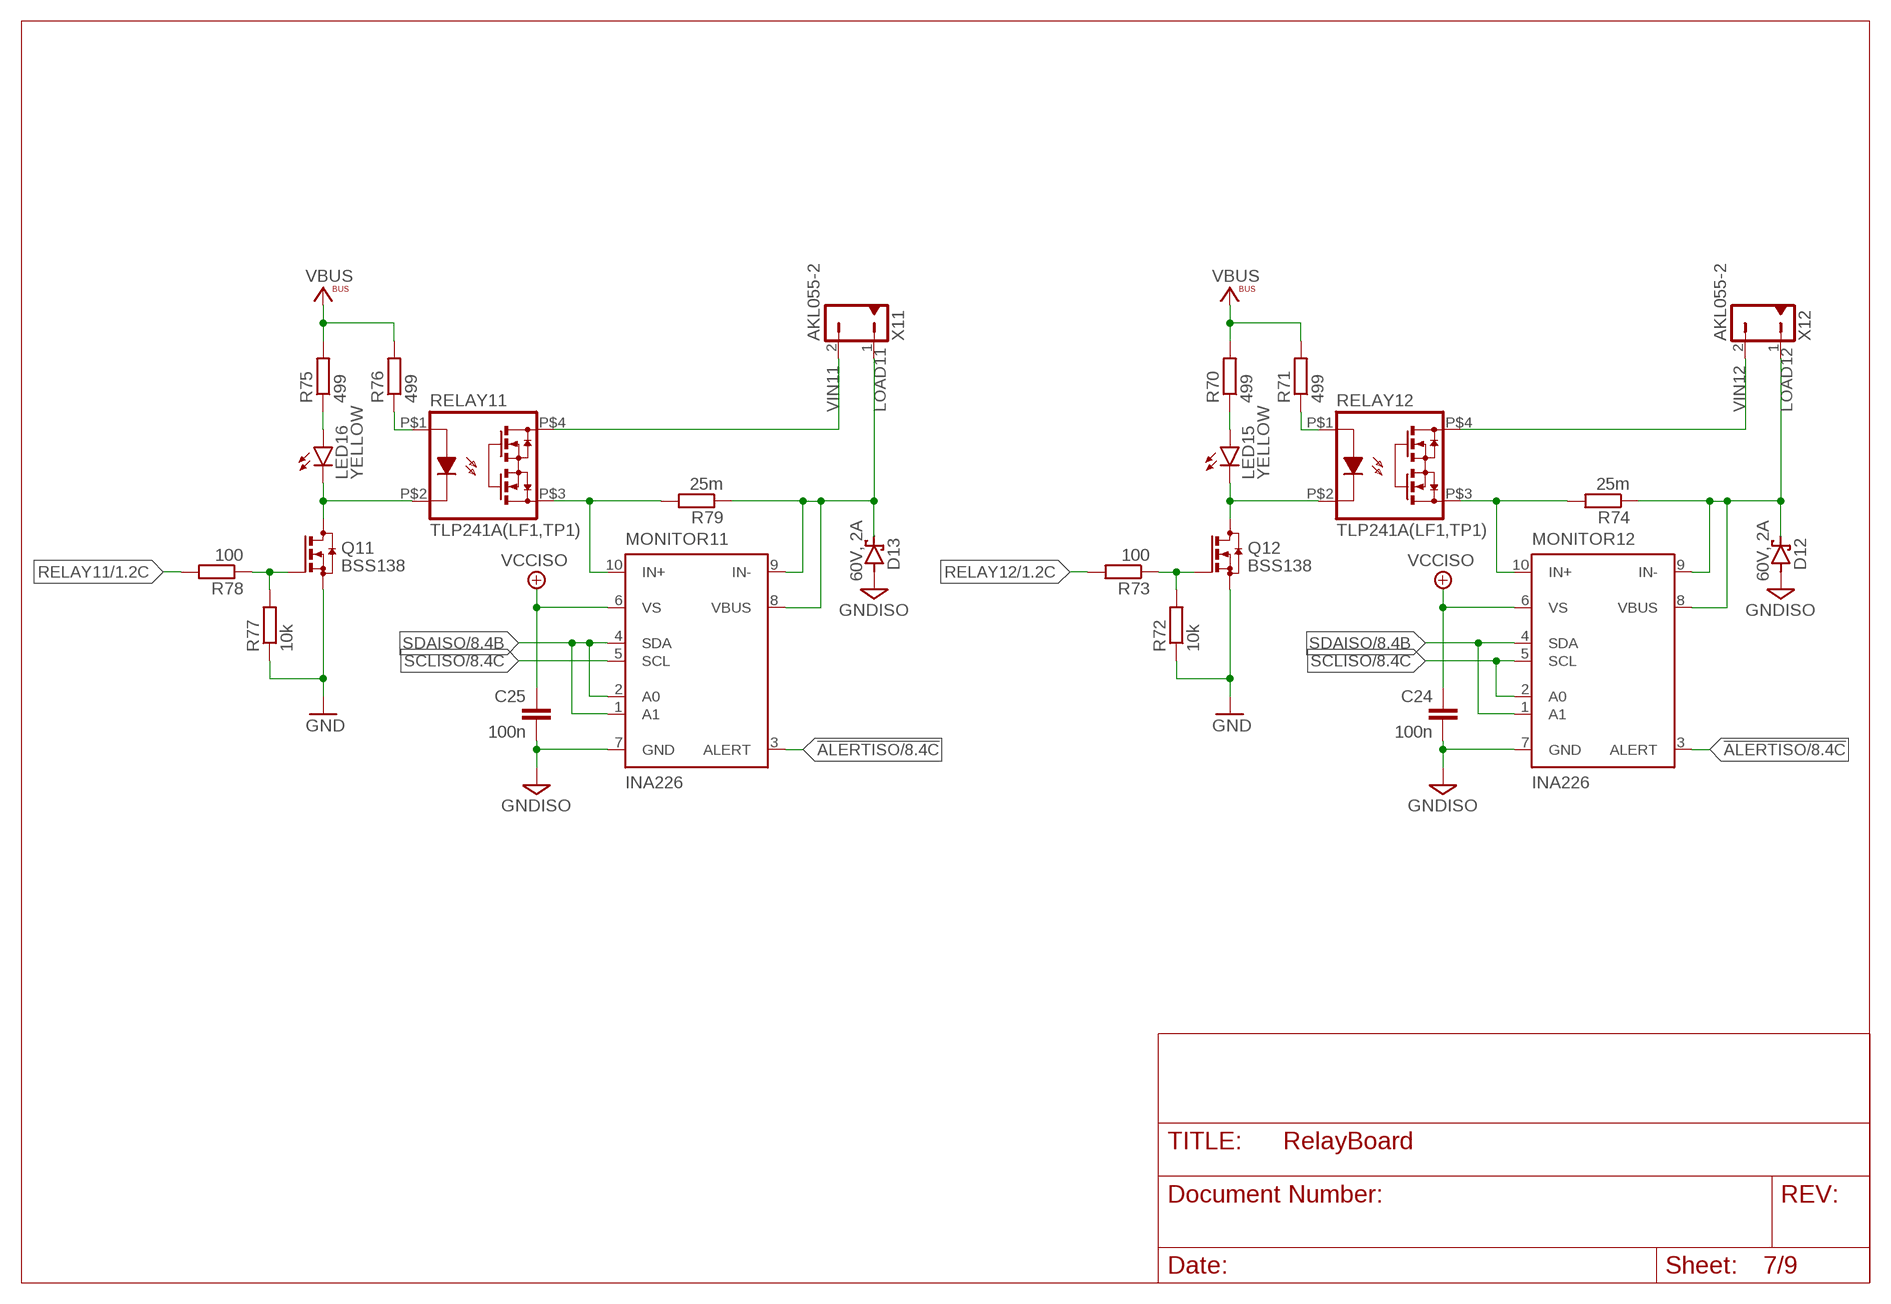
[diagram p6: schematic, sheet 7]

### Parts
C24  100n  C-EUC0603  [C0603]
C25  100n  C-EUC0603  [C0603]
D12  60V, 2A  SCHOTTKY-DIODESMD  [SMB]
D13  60V, 2A  SCHOTTKY-DIODESMD  [SMB]
LED15  YELLOW  LEDCHIPLED_0805  [CHIPLED_0805]
LED16  YELLOW  LEDCHIPLED_0805  [CHIPLED_0805]
MONITOR11  INA226  [MSOP10]
MONITOR12  INA226  [MSOP10]
Q11  BSS138  [SOT23]
Q12  BSS138  [SOT23]
R70  499  R-EU_R0603  [R0603]
R71  499  R-EU_R0603  [R0603]
R72  10k  R-EU_R0603  [R0603]
R73  100  R-EU_R0603  [R0603]
R74  25m  R-EU_R1206  [R1206]
R75  499  R-EU_R0603  [R0603]
R76  499  R-EU_R0603  [R0603]
R77  10k  R-EU_R0603  [R0603]
R78  100  R-EU_R0603  [R0603]
R79  25m  R-EU_R1206  [R1206]
RELAY11  TLP241A(LF1,TP1)  [TP1/5]
RELAY12  TLP241A(LF1,TP1)  [TP1/5]
X11  AKL055-2  [AKL055-2]
X12  AKL055-2  [AKL055-2]

### Nets
!ALERTISO: MONITOR11.3(ALERT) MONITOR12.3(ALERT) ; also sheet 1,2,3,4,5,6,8,9
GND: Q11.2(S) Q12.2(S) R72.1 R77.1 ; also sheet 1,2,3,4,5,6,8,9
GNDISO: C24.2 C25.2 D12.A D13.A MONITOR11.7(GND) MONITOR12.7(GND) ; also sheet 1,2,3,4,5,6,8,9
LOAD11: D13.C MONITOR11.8(VBUS) MONITOR11.9(IN-) R79.1 X11.1
LOAD12: D12.C MONITOR12.8(VBUS) MONITOR12.9(IN-) R74.1 X12.1
N$88: LED15.A R70.1
N$89: LED15.C Q12.3(D) RELAY12.P$2(CATHODE)
N$90: Q12.1(G) R72.2 R73.1
N$91: MONITOR12.10(IN+) R74.2 RELAY12.P$3(DRAIN1)
N$94: R71.1 RELAY12.P$1(ANODE)
N$95: LED16.A R75.1
N$96: LED16.C Q11.3(D) RELAY11.P$2(CATHODE)
N$97: Q11.1(G) R77.2 R78.1
N$98: MONITOR11.10(IN+) R79.2 RELAY11.P$3(DRAIN1)
N$101: R76.1 RELAY11.P$1(ANODE)
RELAY11: R78.2 ; also sheet 1
RELAY12: R73.2 ; also sheet 1
SCLISO: MONITOR11.5(SCL) MONITOR12.2(A0) MONITOR12.5(SCL) ; also sheet 1,2,3,4,5,6,8,9
SDAISO: MONITOR11.1(A1) MONITOR11.2(A0) MONITOR11.4(SDA) MONITOR12.1(A1) MONITOR12.4(SDA) ; also sheet 1,2,3,4,5,6,8,9
VBUS: R70.2 R71.2 R75.2 R76.2 ; also sheet 1,2,3,4,5,6,8,9
VCCISO: C24.1 C25.1 MONITOR11.6(VS) MONITOR12.6(VS) ; also sheet 1,2,3,4,5,6,8,9
VIN11: RELAY11.P$4(DRAIN2) X11.2
VIN12: RELAY12.P$4(DRAIN2) X12.2

## Sheet 8 of 9: Relays 7
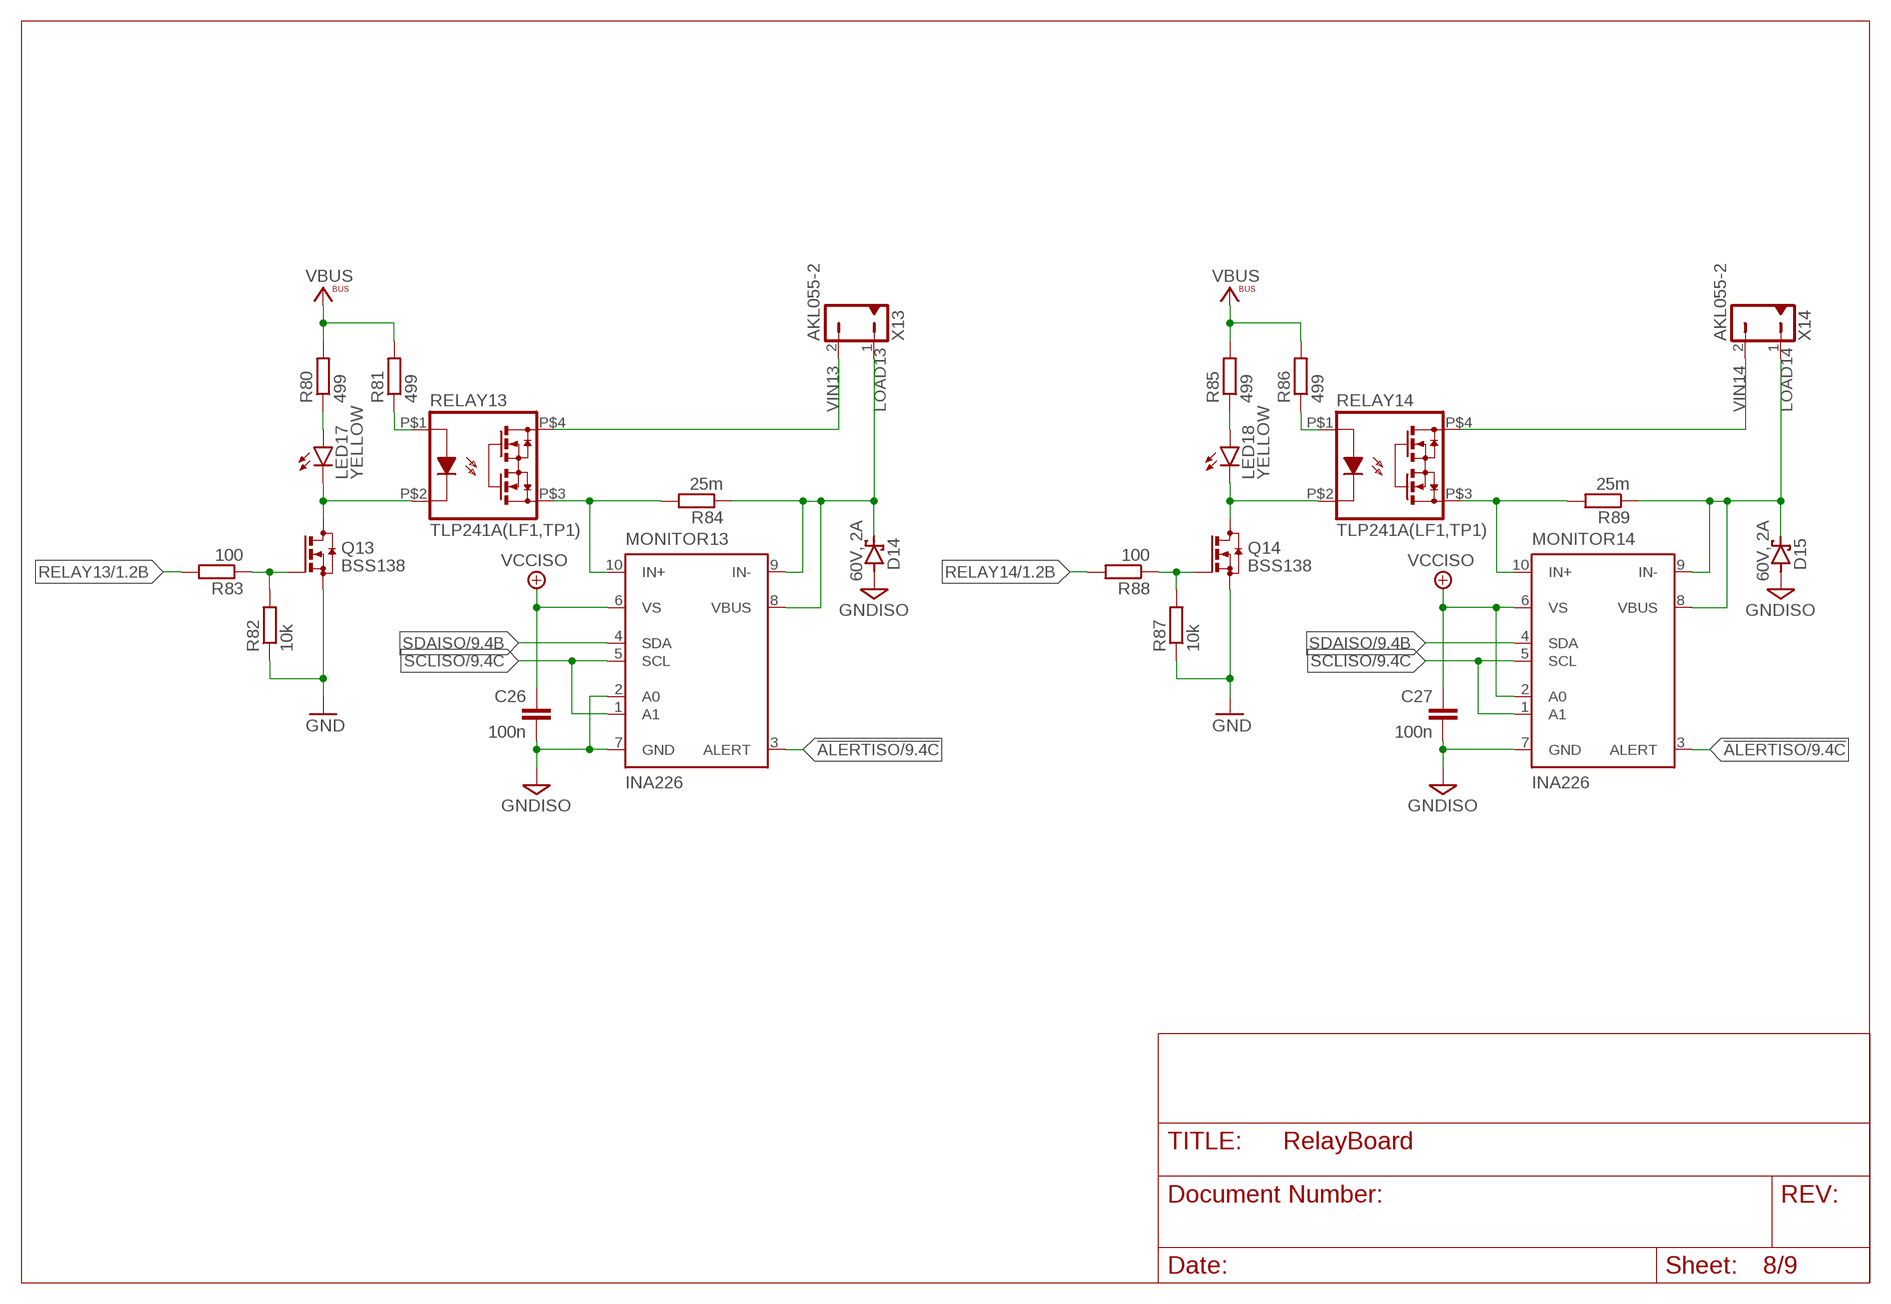
[diagram p7: schematic, sheet 8]

### Parts
C26  100n  C-EUC0603  [C0603]
C27  100n  C-EUC0603  [C0603]
D14  60V, 2A  SCHOTTKY-DIODESMD  [SMB]
D15  60V, 2A  SCHOTTKY-DIODESMD  [SMB]
LED17  YELLOW  LEDCHIPLED_0805  [CHIPLED_0805]
LED18  YELLOW  LEDCHIPLED_0805  [CHIPLED_0805]
MONITOR13  INA226  [MSOP10]
MONITOR14  INA226  [MSOP10]
Q13  BSS138  [SOT23]
Q14  BSS138  [SOT23]
R80  499  R-EU_R0603  [R0603]
R81  499  R-EU_R0603  [R0603]
R82  10k  R-EU_R0603  [R0603]
R83  100  R-EU_R0603  [R0603]
R84  25m  R-EU_R1206  [R1206]
R85  499  R-EU_R0603  [R0603]
R86  499  R-EU_R0603  [R0603]
R87  10k  R-EU_R0603  [R0603]
R88  100  R-EU_R0603  [R0603]
R89  25m  R-EU_R1206  [R1206]
RELAY13  TLP241A(LF1,TP1)  [TP1/5]
RELAY14  TLP241A(LF1,TP1)  [TP1/5]
X13  AKL055-2  [AKL055-2]
X14  AKL055-2  [AKL055-2]

### Nets
!ALERTISO: MONITOR13.3(ALERT) MONITOR14.3(ALERT) ; also sheet 1,2,3,4,5,6,7,9
GND: Q13.2(S) Q14.2(S) R82.1 R87.1 ; also sheet 1,2,3,4,5,6,7,9
GNDISO: C26.2 C27.2 D14.A D15.A MONITOR13.2(A0) MONITOR13.7(GND) MONITOR14.7(GND) ; also sheet 1,2,3,4,5,6,7,9
LOAD13: D14.C MONITOR13.8(VBUS) MONITOR13.9(IN-) R84.1 X13.1
LOAD14: D15.C MONITOR14.8(VBUS) MONITOR14.9(IN-) R89.1 X14.1
N$102: LED17.A R80.1
N$103: LED17.C Q13.3(D) RELAY13.P$2(CATHODE)
N$104: Q13.1(G) R82.2 R83.1
N$105: MONITOR13.10(IN+) R84.2 RELAY13.P$3(DRAIN1)
N$108: R81.1 RELAY13.P$1(ANODE)
N$109: LED18.A R85.1
N$110: LED18.C Q14.3(D) RELAY14.P$2(CATHODE)
N$111: Q14.1(G) R87.2 R88.1
N$112: MONITOR14.10(IN+) R89.2 RELAY14.P$3(DRAIN1)
N$115: R86.1 RELAY14.P$1(ANODE)
RELAY13: R83.2 ; also sheet 1
RELAY14: R88.2 ; also sheet 1
SCLISO: MONITOR13.1(A1) MONITOR13.5(SCL) MONITOR14.1(A1) MONITOR14.5(SCL) ; also sheet 1,2,3,4,5,6,7,9
SDAISO: MONITOR13.4(SDA) MONITOR14.4(SDA) ; also sheet 1,2,3,4,5,6,7,9
VBUS: R80.2 R81.2 R85.2 R86.2 ; also sheet 1,2,3,4,5,6,7,9
VCCISO: C26.1 C27.1 MONITOR13.6(VS) MONITOR14.2(A0) MONITOR14.6(VS) ; also sheet 1,2,3,4,5,6,7,9
VIN13: RELAY13.P$4(DRAIN2) X13.2
VIN14: RELAY14.P$4(DRAIN2) X14.2

## Sheet 9 of 9: Relays 8
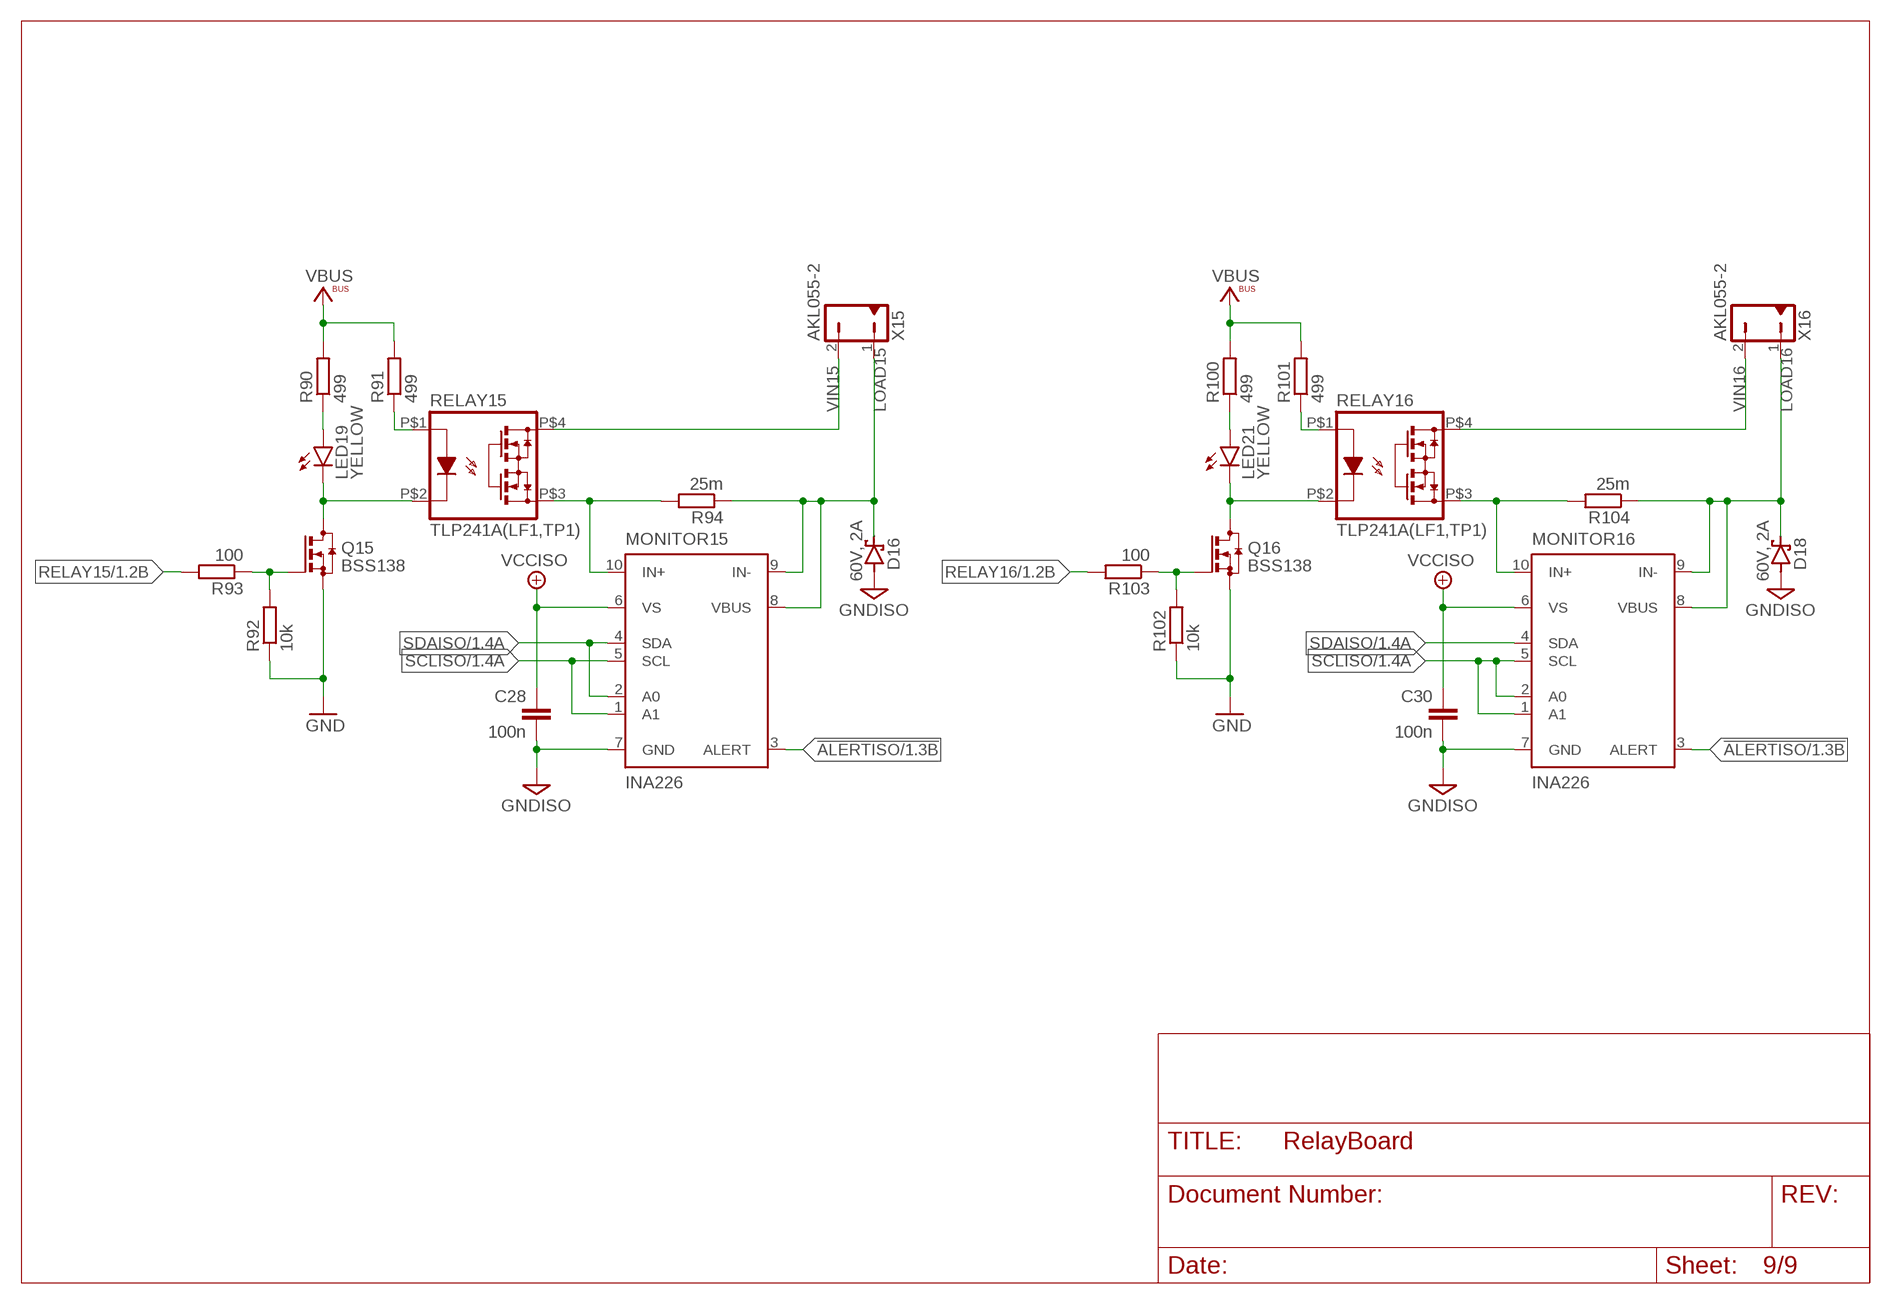
[diagram p8: schematic, sheet 9]

### Parts
C28  100n  C-EUC0603  [C0603]
C30  100n  C-EUC0603  [C0603]
D16  60V, 2A  SCHOTTKY-DIODESMD  [SMB]
D18  60V, 2A  SCHOTTKY-DIODESMD  [SMB]
LED19  YELLOW  LEDCHIPLED_0805  [CHIPLED_0805]
LED21  YELLOW  LEDCHIPLED_0805  [CHIPLED_0805]
MONITOR15  INA226  [MSOP10]
MONITOR16  INA226  [MSOP10]
Q15  BSS138  [SOT23]
Q16  BSS138  [SOT23]
R90  499  R-EU_R0603  [R0603]
R91  499  R-EU_R0603  [R0603]
R92  10k  R-EU_R0603  [R0603]
R93  100  R-EU_R0603  [R0603]
R94  25m  R-EU_R1206  [R1206]
R100  499  R-EU_R0603  [R0603]
R101  499  R-EU_R0603  [R0603]
R102  10k  R-EU_R0603  [R0603]
R103  100  R-EU_R0603  [R0603]
R104  25m  R-EU_R1206  [R1206]
RELAY15  TLP241A(LF1,TP1)  [TP1/5]
RELAY16  TLP241A(LF1,TP1)  [TP1/5]
X15  AKL055-2  [AKL055-2]
X16  AKL055-2  [AKL055-2]

### Nets
!ALERTISO: MONITOR15.3(ALERT) MONITOR16.3(ALERT) ; also sheet 1,2,3,4,5,6,7,8
GND: Q15.2(S) Q16.2(S) R92.1 R102.1 ; also sheet 1,2,3,4,5,6,7,8
GNDISO: C28.2 C30.2 D16.A D18.A MONITOR15.7(GND) MONITOR16.7(GND) ; also sheet 1,2,3,4,5,6,7,8
LOAD15: D16.C MONITOR15.8(VBUS) MONITOR15.9(IN-) R94.1 X15.1
LOAD16: D18.C MONITOR16.8(VBUS) MONITOR16.9(IN-) R104.1 X16.1
N$116: LED19.A R90.1
N$117: LED19.C Q15.3(D) RELAY15.P$2(CATHODE)
N$118: Q15.1(G) R92.2 R93.1
N$119: MONITOR15.10(IN+) R94.2 RELAY15.P$3(DRAIN1)
N$122: R91.1 RELAY15.P$1(ANODE)
N$130: LED21.A R100.1
N$131: LED21.C Q16.3(D) RELAY16.P$2(CATHODE)
N$132: Q16.1(G) R102.2 R103.1
N$133: MONITOR16.10(IN+) R104.2 RELAY16.P$3(DRAIN1)
N$136: R101.1 RELAY16.P$1(ANODE)
RELAY15: R93.2 ; also sheet 1
RELAY16: R103.2 ; also sheet 1
SCLISO: MONITOR15.1(A1) MONITOR15.5(SCL) MONITOR16.1(A1) MONITOR16.2(A0) MONITOR16.5(SCL) ; also sheet 1,2,3,4,5,6,7,8
SDAISO: MONITOR15.2(A0) MONITOR15.4(SDA) MONITOR16.4(SDA) ; also sheet 1,2,3,4,5,6,7,8
VBUS: R90.2 R91.2 R100.2 R101.2 ; also sheet 1,2,3,4,5,6,7,8
VCCISO: C28.1 C30.1 MONITOR15.6(VS) MONITOR16.6(VS) ; also sheet 1,2,3,4,5,6,7,8
VIN15: RELAY15.P$4(DRAIN2) X15.2
VIN16: RELAY16.P$4(DRAIN2) X16.2

## Library data of the parts
C1-C28 C30 = rcl:C-EU: CAPACITOR, European symbol; SPICEPREFIX: C
D1 D3-D16 D18 = diode:SCHOTTKY-DIODE: Schottky Diode; FBS_ID: 1101
F1 = Fuse0603:FUSE: Surface mount fuse
F2 = Littelfuse:SMF_OMNIBLOK_154: Littlefuse SMF OMNI-BLOK (R) Fuse Holder with Installed Fuse (NANO2 SMF): Series 154
H1-H4 = holes:MOUNT-HOLE: MOUNTING HOLE with drill center marker
IC1 = STM32:STM32L412K*?: Ultra-low-power ARM Cortex-M4 32-bit MCU+FPU, 100DMIPS, up to 128KB Flash, 40KB SRAM, analog, ext. SMPS
IC2 = PESE1-M:PESE1-S5-S*-M: DC-DC CONVERTER, 1 W isolated, unregulated output, 3 kVdc isolation
IC3 = ISO154X:ISO1541: Low-Power Bidirectional I2C Isolators
IC4 = HMHA281:HMHA281: DC Input Half Pitch Mini-Flat Package 4-Pin Optocouplers
J1 = ZX62-B-5PA(33):ZX62-B-5PA(33): ZX Series 5 Position Right Angle PCB Wire Micro B USB Plug; DESCRIPTION: USB - micro B USB 2.0 Receptacle Connector 5 Position Surface Mount, Right Angle; DIGI-KEY_PART_NUMBER: H125270CT-ND; MF: Hirose; MP: ZX62-B-5PA(33); PACKAGE: None; PURCHASE-URL: https://pricing.snapeda.com/search/part/ZX62-B-5PA(33)/?ref=eda
J2 = WR-PHD:6210XX21021_62101021021: WR-PHD 1.27 mm SMT Dual Pin Header, H=3.80 mm ARTICLE PROPERTIES: Pins:4;​ 8;​ 10;​ 14;​ 16;​ 20;​ 28;​ 40;​ 44;​ 50 KIND PROPERTIES: Pitch：1.27 mm Quality Class:3 as per CECC 75 301-802 Rows：Dual Gender：Pin Header Type：Straight MATERIAL PROPERTIES: Insulator Material :PA9T Insulator Flammability Rating:UL94 V-0 Contact Material:Copper Alloy Contact Plating:Gold Contact Type:Stamped GENERAL INFORMATION Operating Temperature:-40 up to +105 °C Compliance:Lead free / RoHS ELECTRICAL PROPERTIES: Rated Current:1 A;​ max. IR1:1 A Withstanding Voltage:500 V (AC) Contact Resistance:20 mΩ RISO:1000 MΩ CERTIFICATION UL Approval:E323964 PACKAGING PROPERTIES Packaging:Tube Packaging Unit:228;​ 114;​ 91;​ 65;​ 57;​ 45;​ 32;​ 23;​ 20;​ 18 <https://katalog.we-online.com/media/images/v2/o33195v209%20Family_WR-PDH_621xxx21021.jpg> Details see: https://katalog.we-online.com/en/em/PHD_1_27_SMT_DUAL_PIN_HEADER_6210XX21021 Updated by Yingchun,Shan 2019-10-25 2019 (C) Würth Elektronik; DATASHEET-URL: https://katalog.we-online.com/em/datasheet/62101021021.pdf; GENDER: Pin Header; IR: 1A; MATES: WR-PHD 1.27mm Dual Socket Header/SMT Dual Socket Header,H=4.5mm/SMT Dual Socket Header,H=4.5mm(Reel); PACKAGING: Tube; PART-NUMBER: 62101021021; PINS: 10; ROWS: Dual; TYPE: Straight
LED1 = DualLED:DUAL0805: Kingbright APHBM2012SURKCGKC (www.digikey.de/product-detail/de/kingbright/APHBM2012SURKCGKC/754-1093-1-ND/1747810)
LED2-LED4 LED6-LED19 LED21 = led:LED: LED OSRAM: - CHIPLED LG R971, LG N971, LY N971, LG Q971, LY Q971, LO R971, LY R971 LH N974, LH R974 LS Q976, LO Q976, LY Q976 LO Q996 - Hyper CHIPLED LW Q18S LB Q993, LB Q99A, LB R99A - SideLED LS A670, LO A670, LY A670, LG A670, LP A670 LB A673, LV A673, LT A673, LW A673 LH A674 LY A675 LS A676, LA A676, LO A676, LY A676, LW A676 LS A679, LY A679, LG A679 - Hyper Micro SIDELED® LS Y876, LA Y876, LO Y876, LY Y876 LT Y87S - SmartLED LW L88C, LW L88S LB L89C, LB L89S, LG L890 LS L89K, LO L89K, LY L89K LS L896, LA L896, LO L896, LY L896 - TOPLED LS T670, LO T670, LY T670, LG T670, LP T670 LSG T670, LSP T670, LSY T670, LOP T670, LYG T670 LG T671, LOG T671, LSG T671 LB T673, LV T673, LT T673, LW T673 LH T674 LS T676, LA T676, LO T676, LY T676, LB T676, LH T676, LSB T676, LW T676 LB T67C, LV T67C, LT T67C, LS T67K, LO T67K, LY T67K, LW E67C LS E67B, LA E67B, LO E67B, LY E67B, LB E67C, LV E67C, LT E67C LW T67C LS T679, LY T679, LG T679 LS T770, LO T770, LY T770, LG T770, LP T770 LB T773, LV T773, LT T773, LW T773 LH T774 LS E675, LA E675, LY E675, LS T675 LS T776, LA T776, LO T776, LY T776, LB T776 LHGB T686 LT T68C, LB T68C - Hyper Mini TOPLED® LB M676 - Mini TOPLED Santana® LG M470 LS M47K, LO M47K, LY M47K Source: http://www.osram.convergy.de LUXEON: - LUMILED® LXK2-PW12-R00, LXK2-PW12-S00, LXK2-PW14-U00, LXK2-PW14-V00 LXK2-PM12-R00, LXK2-PM12-S00, LXK2-PM14-U00 LXK2-PE12-Q00, LXK2-PE12-R00, LXK2-PE12-S00, LXK2-PE14-T00, LXK2-PE14-U00 LXK2-PB12-K00, LXK2-PB12-L00, LXK2-PB12-M00, LXK2-PB14-N00, LXK2-PB14-P00, LXK2-PB14-Q00 LXK2-PR12-L00, LXK2-PR12-M00, LXK2-PR14-Q00, LXK2-PR14-R00 LXK2-PD12-Q00, LXK2-PD12-R00, LXK2-PD12-S00 LXK2-PH12-R00, LXK2-PH12-S00 LXK2-PL12-P00, LXK2-PL12-Q00, LXK2-PL12-R00 Source: www.luxeon.com KINGBRIGHT: KA-3528ASYC Source: www.kingbright.com
MONITOR1-MONITOR16 = INA226:INA226: High- or Low-Side Measurement, Bi-Directional Current/Power Monitor with I2C Interface
Q1-Q16 = BSS138:BSS138: N-CHANNEL MOS FET
R1-R19 R25-R94 R100-R104 = rcl:R-EU_: RESISTOR, European symbol; SPICEPREFIX: R
RELAY1-RELAY16 = TLP241A:TLP241A(?): Photocouplers/Photorelay, 40 V, 2 A, 5 kVrms isolation voltage
S1 = 25000N:25336N: 25000N series Professional slide switches
TP1-TP4 = Testpoints:TP: KEYSTONE SURFACE MOUNT TEST POINTS
U1 = USBLC6-2:USBLC6-2: Very low capacitance ESD protection
U2 = LP2985:LP2985?-*: LP2985-N Micropower 150-mA Low-Noise Ultra-Low-Dropout Regulator in a SOT-23 Package Designed for Use With Very Low ESR Output Capacitors
X1-X16 = AKL055:AKL055-2
X17 = AKL055:AKL055-4